# EAGLE board SuperLongboard-Lite 1.3.0 (EAGLE 9.7.0), part 1 of 3
REV: F
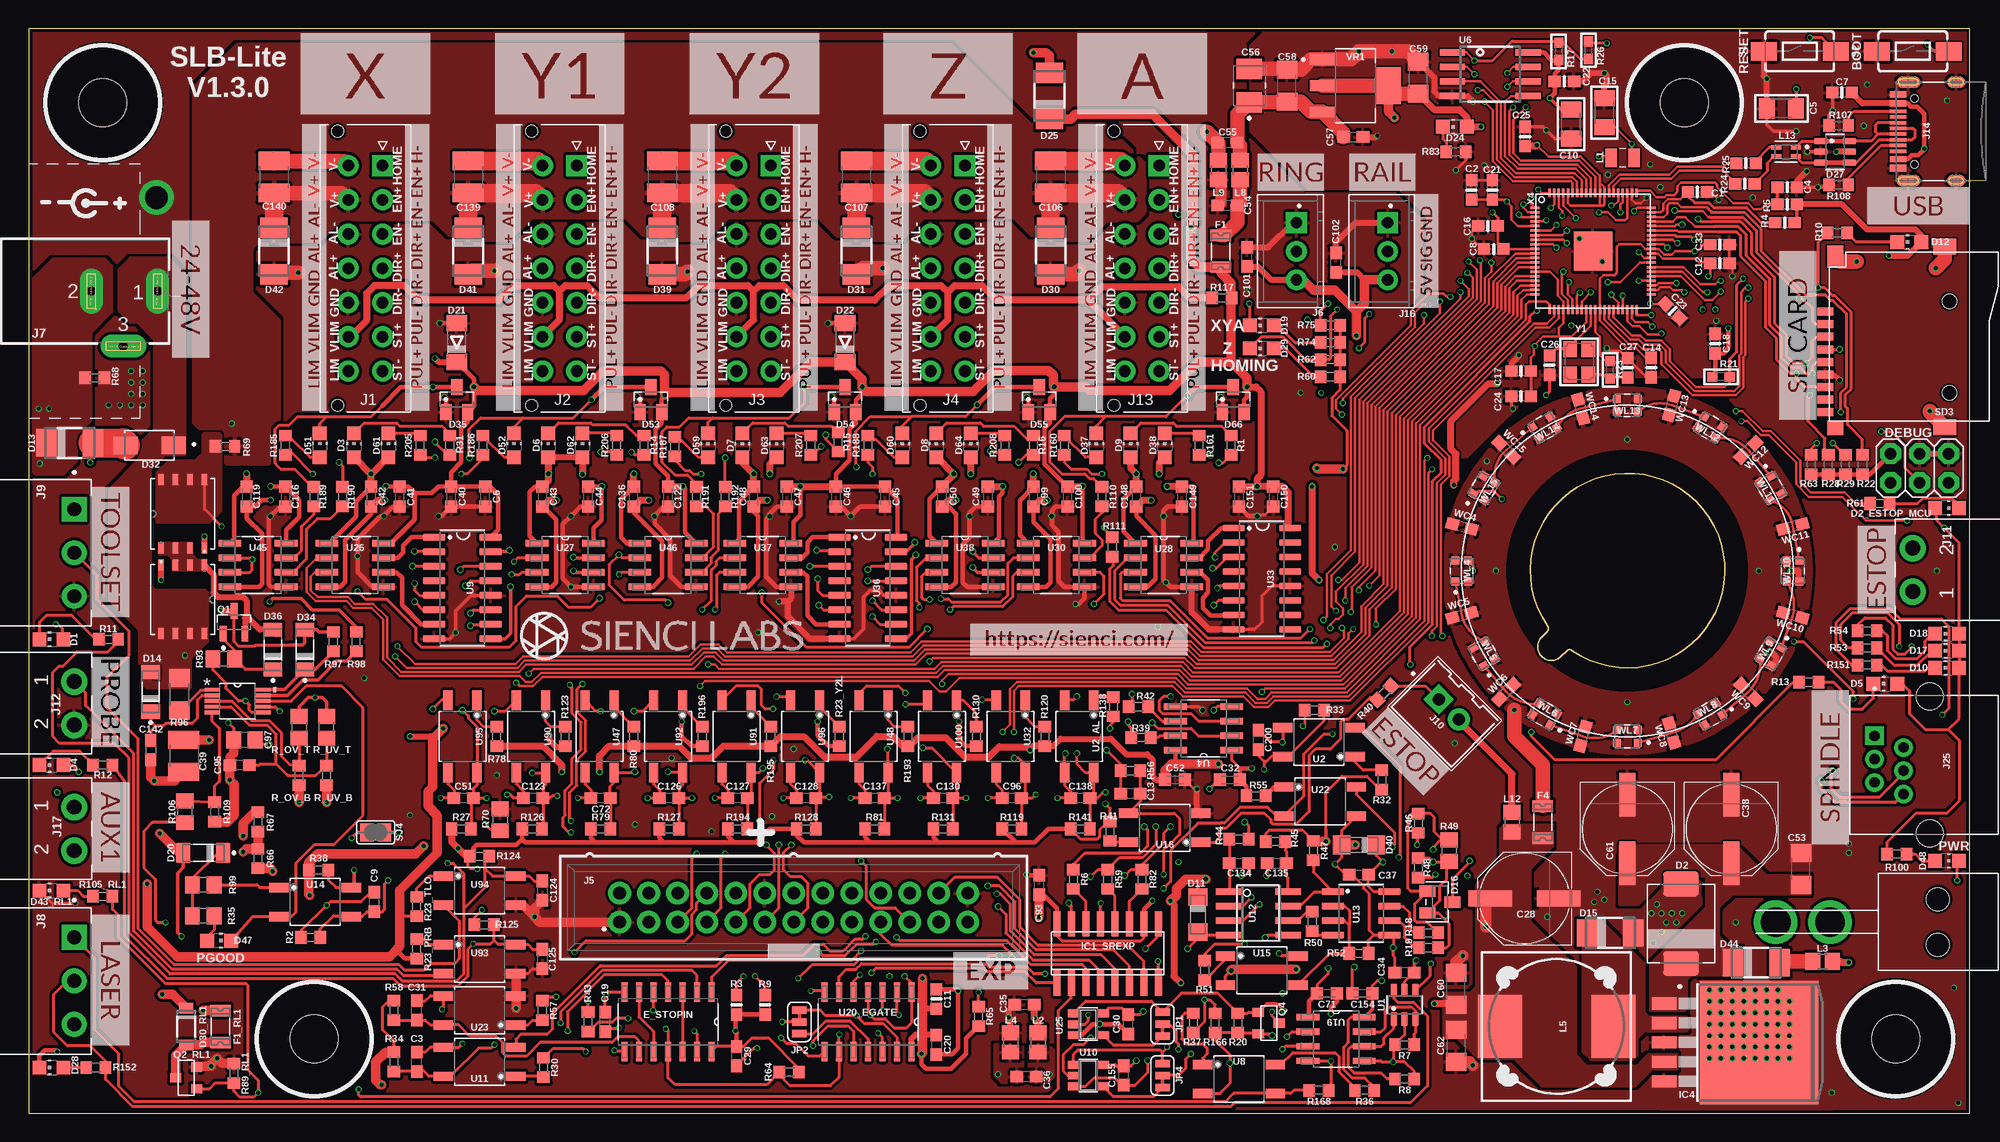
[diagram p12: board, top side]
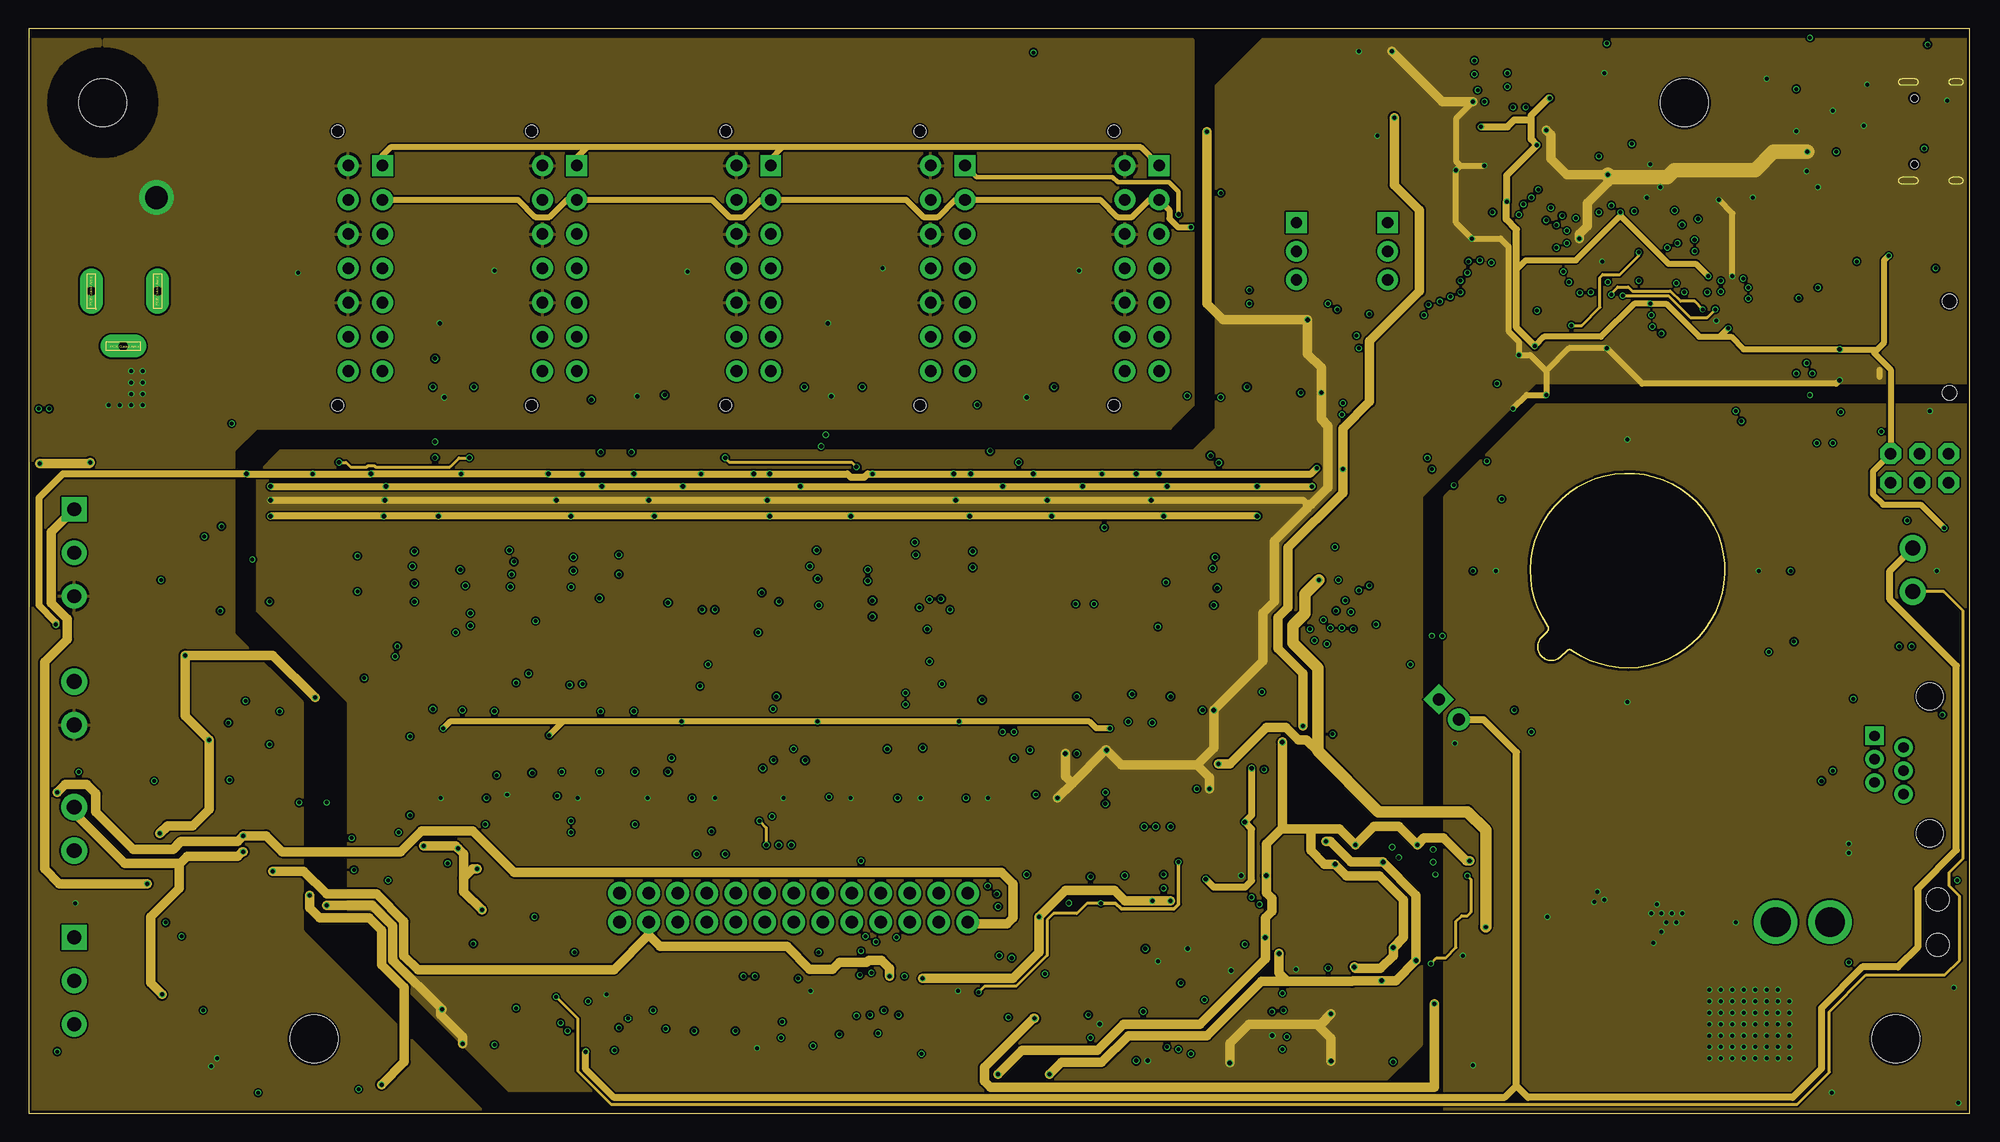
[diagram p13: board, inner layer Route2]
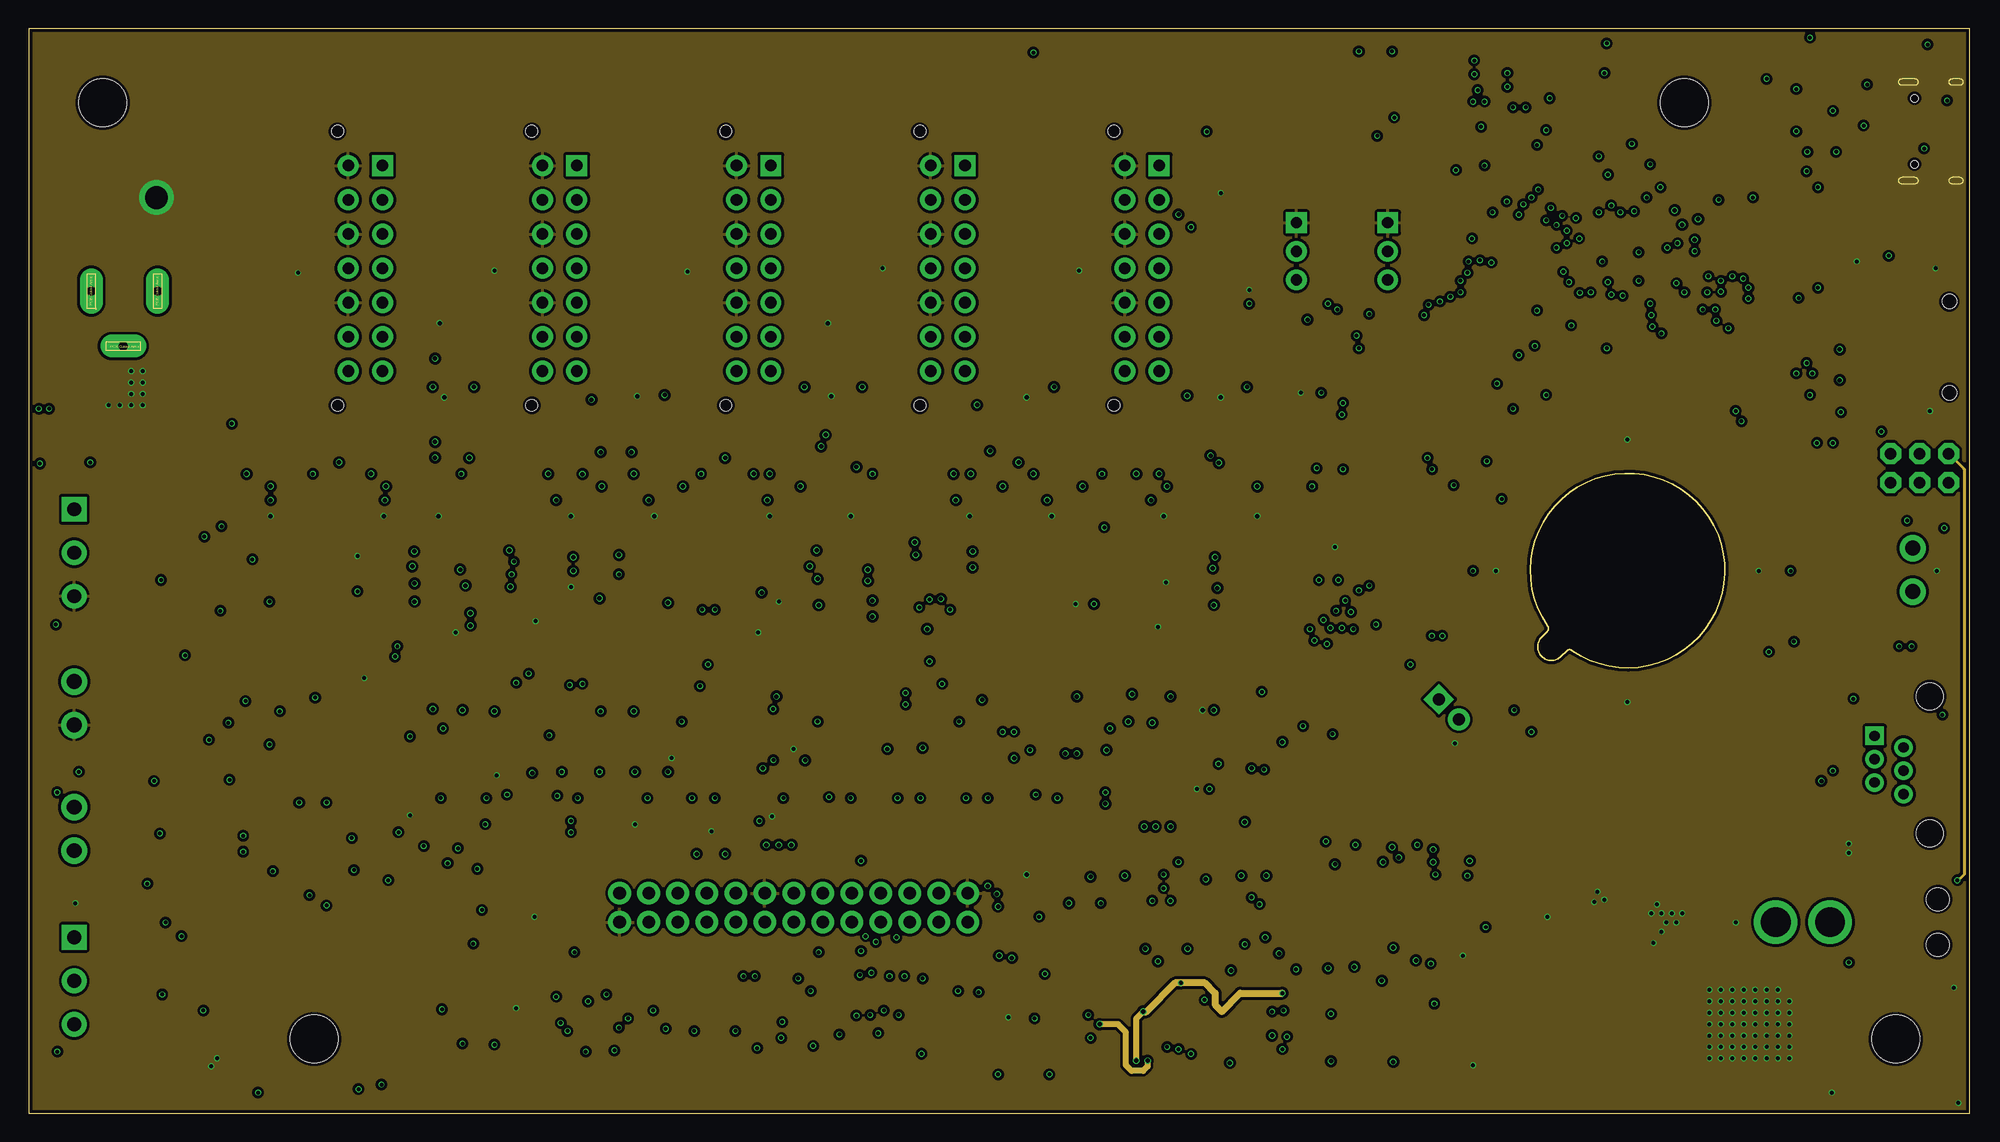
[diagram p14: board, inner layer Route15]
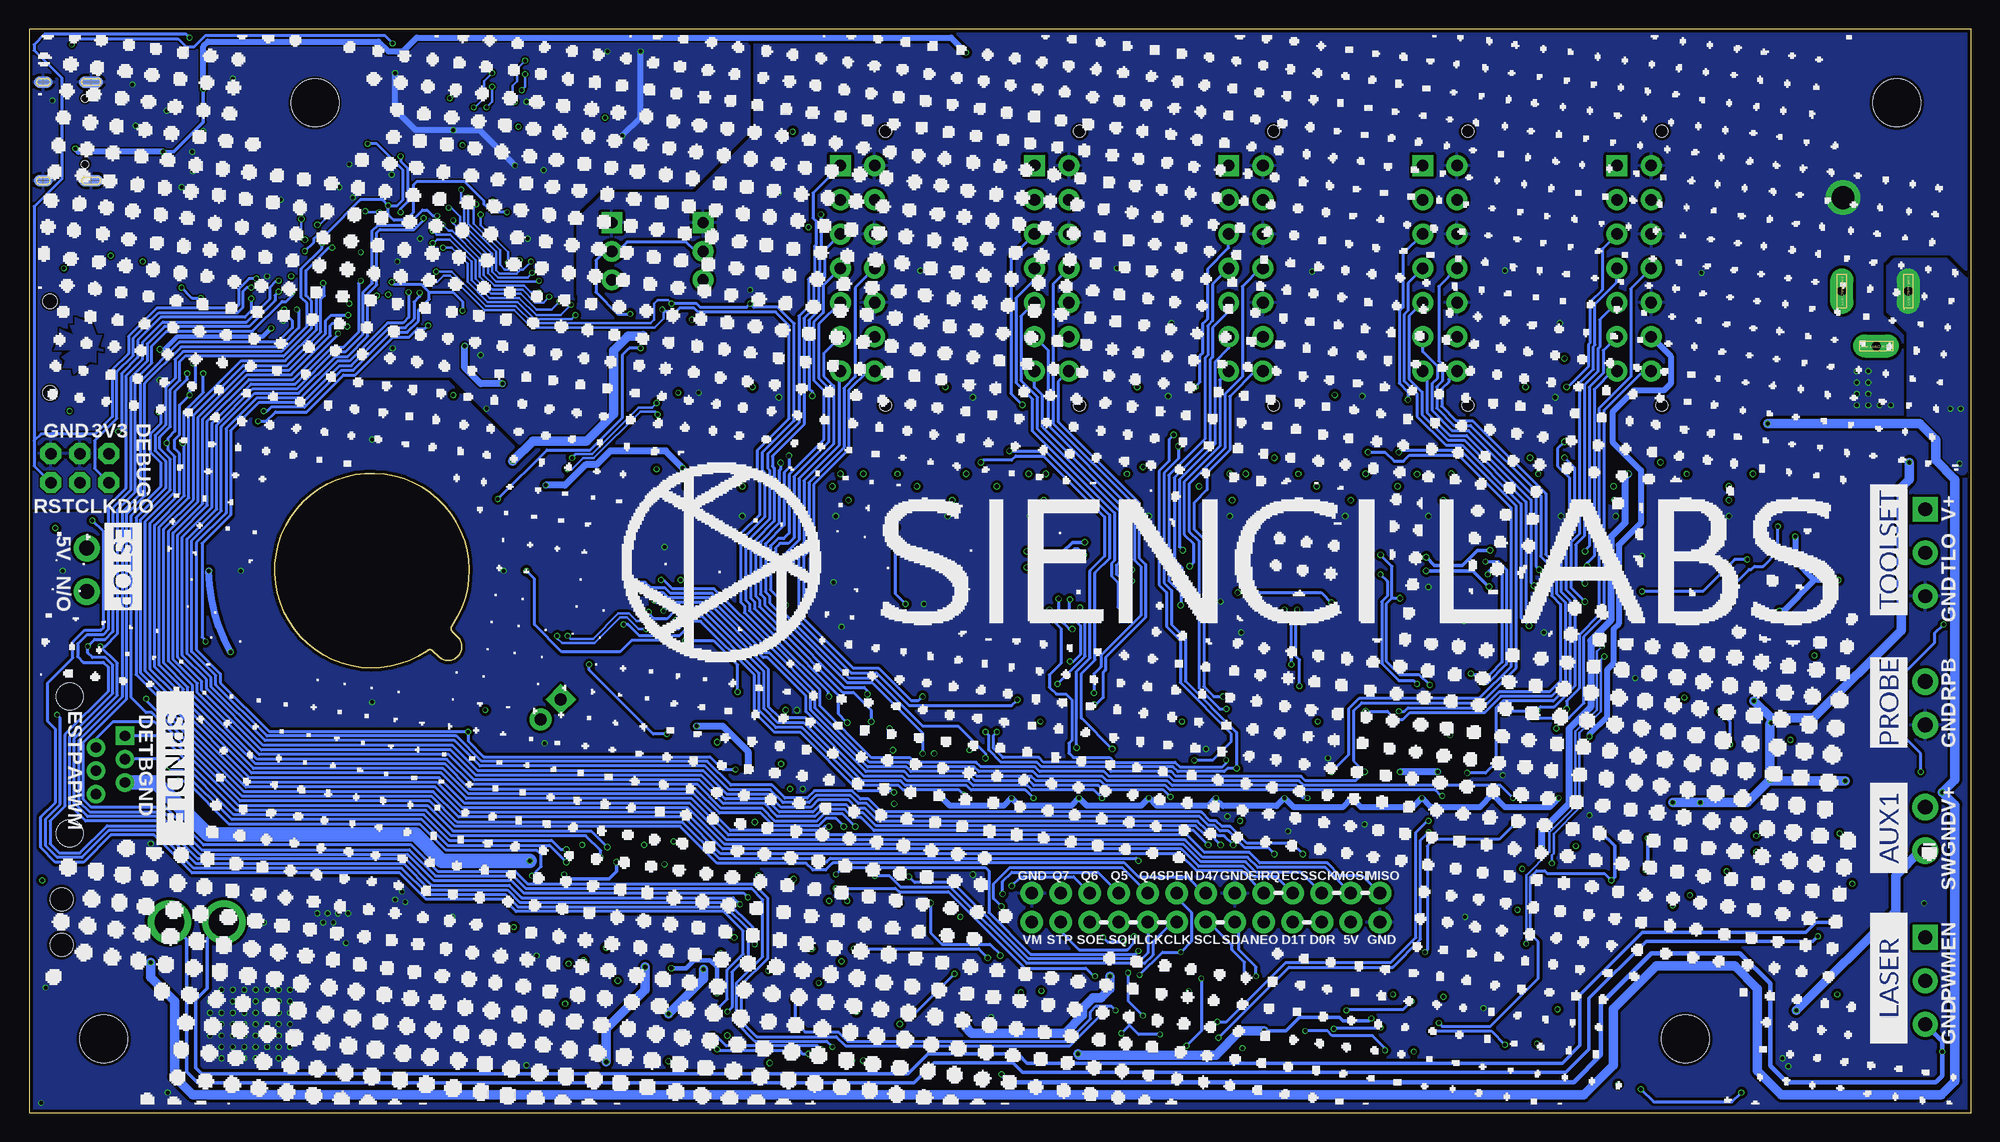
[diagram p15: board, bottom side, seen from below]

Size 170 x 95 mm. Coordinates in mm from the lower left corner, seen from the top.
Outline: 0,0 170,0 170,95 0,95 0,0
Outline: 133,42.7 arc-339 135.2,40.5 arc90 134.7,40.5 134.2,40 arc-180 132.5,41.7 133,42.2 arc90 133,42.7
Copper layers (1+2*15+16): Top 0.035mm / dielectric 1.6mm / Route2 0.035mm / dielectric 0.15mm / Route15 0.035mm / dielectric 0.2mm / Bottom 0.035mm
Design rules "jlcpcb-2layers *": minimum track width 5mil, minimum drill 0.3mm, track to track 5mil, track to pad 5mil, pad to pad 5mil, via to via 5mil, smd to smd 5mil, copper to edge 0.2mm, drill to drill 6mil, minimum pad ring 10mil, minimum via ring 3mil, stop-mask expansion 4mil, vias tented up to drill 40mil, thermal gap 10mil
Net classes: 0 default: width 0.152 mm, clearance 0.152 mm
Holes 4.2 mm at 25,6.5 163.5,6.5 145,88.5 6.5,88.5
tRestrict: area 158.4,1.4 to 168.6,11.6; area 1.4,83.4 to 11.6,93.6; area 19.9,1.4 to 30.1,11.6; area 139.9,83.4 to 150.1,93.6; area 129.5,37 to 150.5,58

## Footprints (pad centres in the part's own frame; a part is rotated, then mirrored left to right if it is on the bottom)
0603-NO = smd 1.075 x 1: 1 -0.85,0; 2 0.85,0
C0603 = smd 1.1 x 1: 1 -0.85,0; 2 0.85,0
_1206 = smd 1.4 x 1.8: 1 -1.27,0; 2 1.27,0
C0603K = smd 1.05 x 1.08: 1 -0.875,0; 2 0.875,0
PANASONIC_E = smd 3.8 x 1.4: + 3,0; - -3,0
C1210 = smd 1.6 x 2.7: 1 -1.4,0; 2 1.4,0
C1206 = smd 1.6 x 1.8: 1 -1.4,0; 2 1.4,0
CAPMP3528X210N = smd 1.79 x 2.21: 1 -1.46,0; 2 1.46,0
C0805 = smd 1.3 x 1.5: 1 -0.95,0; 2 0.95,0
CHIP-LED0805 = smd 1.2 x 1.2: A 0,-1.05; C 0,1.05
DIOM7959X262N = smd 2.18 x 3.12: A 3.485,0; C -3.485,0
LL-34 = smd 1.524 x 1.676: A -1.524,0; C 1.524,0
DO-214AC = smd 1.8 x 2.4: A 2.025,0; C -2.025,0
DIO_LL4148 = smd 1.2 x 1.65: A 1.75,0; C -1.75,0
SOT23 = smd 1 x 1.4: 1 -0.95,-1.1; 2 0.95,-1.1; 3 0,1.1
MINIMELF = smd 1.4 x 1.8: A 1.7,0; C -1.7,0
SOT95P280X145-6N = smd 1.21 x 0.59: 1 -1.255,0.95; 2 -1.255,0; 3 -1.255,-0.95; 4 1.255,-0.95; 5 1.255,0; 6 1.255,0.95
SOD123FL = smd 0.91 x 1.22: A 1.625,0; C -1.625,0
DIOM4325X250N = smd 2.12 x 1.5: A 2.115,0; C -2.115,0
SOT95P240X120-3N = smd 1.4 x 1: 1 -1.1,0.95; 2 -1.1,-0.95; 3 1.1,0
2X03 = drill 1.016 octagon: 1 -2.54,-1.27; 2 -2.54,1.27; 3 0,-1.27; 4 0,1.27; 5 2.54,-1.27; 6 2.54,1.27
SOIC127P600X175-14N = smd 1.702 x 0.533: 1 -2.591,3.81; 2 -2.591,2.54; 3 -2.591,1.27; 4 -2.591,0; 5 -2.591,-1.27; 6 -2.591,-2.54; 7 -2.591,-3.81; 8 2.591,-3.81; 9 2.591,-2.54; 10 2.591,-1.27; 11 2.591,0; 12 2.591,1.27; 13 2.591,2.54; 14 2.591,3.81
1206L = smd 1 x 1.8: 1 -1.4,0; 2 1.4,0
SOIC-16 = smd 0.6 x 2.2: 1 -4.445,-2.6; 2 -3.175,-2.6; 3 -1.905,-2.6; 4 -0.635,-2.6; 5 0.635,-2.6; 6 1.905,-2.6; 7 3.175,-2.6; 8 4.445,-2.6; 9 4.445,2.6; 10 3.175,2.6; 11 1.905,2.6; 12 0.635,2.6; 13 -0.635,2.6; 14 -1.905,2.6; 15 -3.175,2.6; 16 -4.445,2.6
TO263-5 = smd 1.067 x 2.159: 1 -3.404,-5.791; 2 -1.702,-5.791; 3 0,-5.791; 4 1.702,-5.791; 5 3.404,-5.791 | smd 10.8 x 10.41: 6 0,2.54
MOLEX_430451414 = drill 1.02 pad 1.52 square: 1 0,0 | drill 1.02 pad 1.52: 2 -3,0; 3 -6,0; 4 -9,0; 5 -12,0; 6 -15,0; 7 -18,0; 8 0,3; 9 -3,3; 10 -6,3; 11 -9,3; 12 -12,3; 13 -15,3; 14 -18,3 | hole 1.02: 3,3.94; -21,3.94
61202621621 = drill 1.1: 1 -15.24,-1.27; 2 -15.24,1.27; 3 -12.7,-1.27; 4 -12.7,1.27; 5 -10.16,-1.27; 6 -10.16,1.27; 7 -7.62,-1.27; 8 -7.62,1.27; 9 -5.08,-1.27; 10 -5.08,1.27; 11 -2.54,-1.27; 12 -2.54,1.27; 13 0,-1.27; 14 0,1.27; 15 2.54,-1.27; 16 2.54,1.27; 17 5.08,-1.27; 18 5.08,1.27; 19 7.62,-1.27; 20 7.62,1.27; 21 10.16,-1.27; 22 10.16,1.27; 23 12.7,-1.27; 24 12.7,1.27; 25 15.24,-1.27; 26 15.24,1.27
JST_B3B-XH-A(LF)(SN) = drill 1 square: 1 2.5,-0.525 | drill 1: 2 0,-0.525; 3 -2.5,-0.525
694108301002 = drill 0.8 pad 2 long: 1 5.8,0; 2 0,0; 3 2.8,-4.8
PHOENIX_1803280 = drill 1.2 pad 1.8 square: 01 2.6,8 | drill 1.2 pad 1.8: 02 6.41,8; 03 10.22,8
JST_B2B-XH-A_(LF)(SN) = drill 1.05 square: 1 1.25,-0.525 | drill 1.05: 2 -1.25,-0.525
MC1.5/2-G-3.81 = drill 1.3: 1 -3.81,8; 2 0,8
USB-C-16P = smd 0.3 x 1.45: A5 -1.25,0; A6 -0.25,0; A7 0.25,0; A8 1.25,0; B5 1.75,0; B6 0.75,0; B7 -0.75,0; B8 -1.75,0 | smd 0.6 x 1.45: GND -3.225,0; GND2 3.225,0 | smd 1 x 2.1: SHLD1 -4.32,-0.915; SHLD2 4.32,-0.915 | smd 1 x 2.1 bottom: SHLD3 -4.32,-0.915; SHLD4 4.32,-0.915 | smd 1 x 1.6: SHLD5 -4.32,-5.095; SHLD8 4.32,-5.095 | smd 1 x 1.6 bottom: SHLD6 -4.32,-5.095; SHLD7 4.32,-5.095 | smd 0.55 x 1.45: VBUS1 -2.45,0; VBUS2 2.45,0 | hole 0.65: -2.89,-1.445; 2.89,-1.445
KH-PCB-6P6C = drill 0.9 square: 1 2.55,4.84 | drill 0.9: 2 1.53,2.3; 3 0.51,4.84; 4 -0.51,2.3; 5 -1.53,4.84; 6 -2.55,2.3 | hole 2.36: -6,0; 6,0
SMT-JUMPER_3_1-NC_TRACE_SILK = smd 0.66 x 1.27: 1 -1.041,0; 2 0,0; 3 1.041,0
INDUCTOR-0806 = smd 1 x 1.6: 1 -1,0; 2 1,0
FB805 = smd 1.3 x 1.5: 1 -0.85,0; 2 0.85,0
DR127 = smd 3.85 x 5.5: 1 -4.975,0; 2 4.975,0
FIL_DLW21HN900SQ2L = smd 0.9 x 0.4: 1 -0.85,-0.4; 2 0.85,-0.4; 3 0.85,0.4; 4 -0.85,0.4
QNMOS_PRPAK5X6_HUA = smd 0.965 x 0.457: 1 -2.997,1.905; 2 -2.997,0.635; 3 -2.997,-0.635; 4 -2.997,-1.905; 5 2.997,-1.905; 6 2.997,-0.635; 7 2.997,0.635; 8 2.997,1.905
SOT95P237X125-3N = smd 1.37 x 0.61: 1 -0.99,0.95; 2 -0.99,-0.95; 3 0.99,0
SOT-23 = smd 0.802 x 0.972: P1 -0.95,-0.917; P2 0.95,-0.917; P3 0,0.917
R0603 = smd 1 x 1.1: 1 -0.85,0; 2 0.85,0
_0603 = smd 0.9 x 0.8: 1 -0.762,0; 2 0.762,0
R0805 = smd 1.3 x 1.5: 1 -0.95,0; 2 0.95,0
R1206 = smd 1.6 x 1.803: 1 -1.422,0; 2 1.422,0
TACTILE_SWITCH_SMD_6.0X3.5MM = smd 2.3 x 1.6: 1 -3.15,0; 2 3.15,0
TF-PULL = smd 0.7 x 1.4: 1 -2.2,-7.62; 2 -1.1,-7.62; 3 0,-7.62; 4 1.1,-7.62; 5 2.2,-7.62; 6 3.3,-7.62; 7 4.4,-7.62; 8 5.5,-7.62; 9 6.6,-7.62 | smd 1.4 x 2: S1 -7.9,2.85; S2 7.9,2.85 | smd 1.28 x 1.4: S3 7.96,-6.75 | smd 1.95 x 1.4: S4 -7.025,-6.75 | hole 1.25: -3.1,3.25; 4.9,3.25
SJ = smd 1.168 x 1.6: 1 -0.762,0; 2 0.762,0
KCD11-BL = drill 2.6 pad 3.81: P$1 0,-14.75; P$2 0,-19.5 | hole 2: -2,-5.3; 2,-5.3
SOT95P280X145-6N' = smd 1.21 x 0.58: 1 -1.255,0.95; 2 -1.255,0; 3 -1.255,-0.95; 4 1.255,-0.95; 5 1.255,0; 6 1.255,0.95
OPTO_EL357N-G = smd 1.676 x 0.813: 1 -3.175,1.27; 2 -3.175,-1.27; 3 3.175,-1.27; 4 3.175,1.27
MUB10A = smd 1.372 x 0.33: 1 -2.197,1; 2 -2.197,0.5; 3 -2.197,0; 4 -2.197,-0.5; 5 -2.197,-1; 6 2.197,-1; 7 2.197,-0.5; 8 2.197,0; 9 2.197,0.5; 10 2.197,1
SOIC127P600X175-8N = smd 1.981 x 0.559: 1 -2.464,1.905; 2 -2.464,0.635; 3 -2.464,-0.635; 4 -2.464,-1.905; 5 2.464,-1.905; 6 2.464,-0.635; 7 2.464,0.635; 8 2.464,1.905
SOIC8_208MIL = smd 0.6 x 2.2: 1 -1.905,-3.315; 2 -0.635,-3.315; 3 0.635,-3.315; 4 1.905,-3.315; 5 1.905,3.315; 6 0.635,3.315; 7 -0.635,3.315; 8 -1.905,3.315
SOIC127P600X175-16N = smd 1.97 x 0.6: 1 -2.475,4.445; 2 -2.475,3.175; 3 -2.475,1.905; 4 -2.475,0.635; 5 -2.475,-0.635; 6 -2.475,-1.905; 7 -2.475,-3.175; 8 -2.475,-4.445; 9 2.475,-4.445; 10 2.475,-3.175; 11 2.475,-1.905; 12 2.475,-0.635; 13 2.475,0.635; 14 2.475,1.905; 15 2.475,3.175; 16 2.475,4.445
SOT23-5 = smd 0.69 x 0.99: 1 -0.95,-1.29; 2 0,-1.29; 3 0.95,-1.29; 4 0.95,1.3; 5 -0.95,1.3
SOIC-8 = smd 0.6 x 2.2: 1 -1.905,-2.6; 2 -0.635,-2.6; 3 0.635,-2.6; 4 1.905,-2.6; 5 1.905,2.6; 6 0.635,2.6; 7 -0.635,2.6; 8 -1.905,2.6
SOIC127P599X175-8N = smd 1.97 x 0.6: 1 -2.47,1.905; 2 -2.47,0.635; 3 -2.47,-0.635; 4 -2.47,-1.905; 5 2.47,-1.905; 6 2.47,-0.635; 7 2.47,0.635; 8 2.47,1.905
AMS1117-3.3 = smd 2.15 x 0.95: 1 -2.9,2.3; 2 -2.9,0; 3 -2.9,-2.3 | smd 2.15 x 3.25: 4 2.9,0
LED_WS2812-2020 = smd 0.7 x 0.7: 1 0.915,-0.55; 2 0.915,0.55; 3 -0.915,0.55; 4 -0.915,-0.55
QFN80 = smd 0.78 x 0.22: 1 -5.09,3.8; 2 -5.09,3.4; 3 -5.09,3; 4 -5.09,2.6; 5 -5.09,2.2; 6 -5.09,1.8; 7 -5.09,1.4; 8 -5.09,1; 9 -5.09,0.6; 10 -5.09,0.2; 11 -5.09,-0.2; 12 -5.09,-0.6; 13 -5.09,-1; 14 -5.09,-1.4; 15 -5.09,-1.8; 16 -5.09,-2.2; 17 -5.09,-2.6; 18 -5.09,-3; 19 -5.09,-3.4; 20 -5.09,-3.8; 41 5.1,-3.8; 42 5.1,-3.4; 43 5.1,-3; 44 5.1,-2.6; 45 5.1,-2.2; 46 5.1,-1.8; 47 5.1,-1.4; 48 5.1,-1; 49 5.1,-0.6; 50 5.1,-0.2; 51 5.1,0.2; 52 5.1,0.6; 53 5.1,1; 54 5.1,1.4; 55 5.1,1.8; 56 5.1,2.2; 57 5.1,2.6; 58 5.1,3; 59 5.1,3.4; 60 5.1,3.8 | smd 0.22 x 0.78: 21 -3.8,-5.1; 22 -3.4,-5.1; 23 -3,-5.1; 24 -2.6,-5.1; 25 -2.2,-5.1; 26 -1.8,-5.1; 27 -1.4,-5.1; 28 -1,-5.1; 29 -0.6,-5.1; 30 -0.2,-5.1; 31 0.2,-5.1; 32 0.6,-5.1; 33 1,-5.1; 34 1.4,-5.1; 35 1.8,-5.1; 36 2.2,-5.1; 37 2.6,-5.1; 38 3,-5.1; 39 3.4,-5.1; 40 3.8,-5.1; 61 3.8,5.1; 62 3.4,5.1; 63 3,5.1; 64 2.6,5.1; 65 2.2,5.1; 66 1.8,5.1; 67 1.4,5.1; 68 1,5.1; 69 0.6,5.1; 70 0.2,5.1; 71 -0.2,5.1; 72 -0.6,5.1; 73 -1,5.1; 74 -1.4,5.1; 75 -1.8,5.1; 76 -2.2,5.1; 77 -2.6,5.1; 78 -3,5.1; 79 -3.4,5.1; 80 -3.8,5.1 | smd 3.4 x 3.4: MNT 0,0
CRYSTAL_3.2X2.5 = smd 1.4 x 1.2: 1 -1.1,-0.8; 2 1.1,0.8; GND1 -1.1,0.8; GND2 1.1,-0.8

## Placement (x,y rotation side)
C1  2.2uF  [0603-NO]  146.15,80.69 0 top
C2  1uF  [0603-NO]  126.36,80.87 90 top
C3  100nF  [C0603]  34,4.5 90 top
C4  2.2uF  [0603-NO]  154,81.1 0 top
C5  10uF  [_1206]  153.5,88 0 top
C6  100nF  [C0603K]  40,54 270 top
C7  100nF  [0603-NO]  158.8,89.4 180 top
C8  100nF  [0603-NO]  128.3,75.68 0 top
C9  100nF  [C0603]  30.3,18.5 90 top
C10  10uF  [_1206]  135.08,86.61 270 top
C11  1uF  [0603-NO]  79.5,10 90 top
C12  1uF  [0603-NO]  148.1,74.45 0 top
C13  100nF  [C0603]  96.5,28 180 top
C14  100nF  [0603-NO]  142.1,65.3 90 top
C15  10uF  [_1206]  138,87.63 270 top
C16  1uF  [0603-NO]  127.8,77.7 180 top
C17  100nF  [0603-NO]  130.7,65 180 top
C18  100nF  [0603-NO]  147.7,67.4 90 top
C19  100nF  [C0603]  50.5,8 90 top
C20  100nF  [C0603]  79.5,6 270 top
C21  100nF  [0603-NO]  128.19,80.87 90 top
C22  100nF  [0603-NO]  134.49,90.38 0 top
C23  100nF  [0603-NO]  143.96,70.27 315 top
C24  100nF  [0603-NO]  130.7,62.8 180 top
C25  100nF  [0603-NO]  131.05,85.54 90 top
C26  15pF  [0603-NO]  133.18,65.51 90 top
C27  15pF  [0603-NO]  140.02,65.28 270 top
C28  220µF 16-50V  [PANASONIC_E]  131,18.8 180 top
C29  100nF  [C0603]  62,5 270 top
C30  100nF  [C0603]  96.3,7.8 90 top
C31  100nF  [C0603]  34,9 90 top
C32  100nF  [C0603K]  105.2,29.2 180 top
C33  100nF  [0603-NO]  148.1,76.07 180 top
C34  100nF  [C0603]  120.5,12.3 180 top
C35  4.7uF 16V  [C0603]  87.2,9.5 180 top
C36  22uF  [C0603]  87.4,3.2 180 top
C37  1uF  [C0603]  116.5,20.9 0 top
C38  100uF 63-100V  [PANASONIC_E]  149.1,24.9 270 top
C39  4.7uF 63V  [C1210]  13.6,31.3 270 top
C40  1uF  [C0603K]  37,54 270 top
C41  100nF  [C0603K]  32.5,54 270 top
C42  100nF  [C0603K]  30,54 270 top
C43  100nF  [C0603K]  45,54 270 top
C44  100nF  [C0603K]  49,54 270 top
C45  100nF  [C0603K]  75,54 270 top
C46  1uF  [C0603K]  70.7,54 270 top
C47  100nF  [C0603K]  66.4,54 270 top
C48  100nF  [C0603K]  63.5,54 270 top
C49  100nF  [C0603K]  84,54 270 top
C50  100nF  [C0603K]  80,54 270 top
C51  100nF  [C0603]  38.1,27.6 180 top
C52  100nF  [C0603K]  100.4,29.2 0 top
C53  10uF 63v  [C1206]  155.2,21.4 90 top
C54  4.7uF  [C0603]  105,79.5 180 top
C55  22uF  [C0603]  105,85 180 top
C56  100uF  [CAPMP3528X210N]  106.9,90 90 top
C57  22uF  [C0603]  116,85.5 0 top
C58  10uF  [C1206]  110.2,90 90 top
C59  10uF  [C1206]  121.7,90.7 90 top
C60  10uF  [C1206]  125,10.9 90 top
C61  100uF 63-100V  [PANASONIC_E]  140,24.9 270 top
C62  10uF  [C1206]  125,5.9 270 top
C71  100nF  [C0603K]  113.7,10.5 0 top
C72  100nF  [C0603]  50.1,27.6 180 top
C93  100nF  [C0603]  88.5,20 90 top
C95  100nF  [C0603]  18.5,30.5 180 top
C96  100nF  [C0603]  86.1,27.6 180 top
C97  47nF  [C0805]  18.9,32.7 180 top
C99  100nF  [C0603K]  88,54 270 top
C100  100nF  [C0603K]  91,54 270 top
C101  100nF  [C0603]  106.7,75 90 top
C102  100nF  [C0603]  114.5,74.5 90 top
C106  2.2uF 100v  [C1210]  89.5,82 270 top
C107  2.2uF 100v  [C1210]  72.5,82 270 top
C108  2.2uF 100v  [C1210]  55.5,82 270 top
C116  100nF  [C0603K]  22.5,54 270 top
C119  100nF  [C0603K]  19.1,54 270 top
C122  100nF  [C0603K]  56,54 270 top
C123  100nF  [C0603]  44.2,27.6 180 top
C124  100nF  [C0603]  45,19.5 270 top
C125  100nF  [C0603]  45,13.5 270 top
C126  100nF  [C0603]  56.1,27.6 180 top
C127  100nF  [C0603]  62.1,27.6 180 top
C128  100nF  [C0603]  68.1,27.6 180 top
C130  100nF  [C0603]  80.1,27.6 180 top
C134  100nF  [C0603]  106,21.9 0 top
C135  100nF  [C0603]  109.3,21.9 0 top
C136  100nF  [C0603K]  53,54 270 top
C137  100nF  [C0603]  74.1,27.6 180 top
C138  100nF  [C0603]  92.1,27.6 180 top
C139  2.2uF 100v  [C1210]  38.5,82 270 top
C140  2.2uF 100v  [C1210]  21.5,82 270 top
C142  100nF  [C0603]  10.7,31.8 270 top
C148  100nF  [C0603K]  97,54 270 top
C149  100nF  [C0603K]  101,54 270 top
C150  100nF  [C0603K]  109,54 270 top
C151  1uF  [C0603K]  106,54 270 top
C154  100nF  [C0603K]  116.8,10.5 180 top
C155  100nF  [C0603]  95.9,3.3 90 top
C200  100nF  [C0603]  107.7,32.7 90 top
D1  YELLOW  [CHIP-LED0805]  2,41.5 90 top
D2  SMCJ54A  [DIOM7959X262N]  144.7,16.6 90 top
D2_ESTOP_MCU  RED  [CHIP-LED0805]  168,53 270 top
D3  YELLOW  [CHIP-LED0805]  28.5,58.5 0 top
D4  YELLOW  [CHIP-LED0805]  2,30.5 90 top
D5  BLUE  [CHIP-LED0805]  162.6,37.6 90 top
D6  YELLOW  [CHIP-LED0805]  45.5,58.5 0 top
D7  YELLOW  [CHIP-LED0805]  62.5,58.5 0 top
D8  YELLOW  [CHIP-LED0805]  79.5,58.5 0 top
D9  YELLOW  [CHIP-LED0805]  96.5,58.5 0 top
D10  WHITE  [CHIP-LED0805]  168,39 90 top
D11  ZMM3V3-M  [LL-34]  102.4,17.4 90 top
D12  GREEN  [CHIP-LED0805]  164.7,76.3 90 top
D13  SS510  [DO-214AC]  3.6,58.7 0 top
D14  LL4148  [DIO_LL4148]  10.7,36.9 90 top
D15  SS510  [DO-214AC]  138.5,15.8 0 top
D16  SM712  [SOT23]  123.6,18.5 270 top
D17  YELLOW  [CHIP-LED0805]  168,40.5 90 top
D18  GREEN  [CHIP-LED0805]  168,42 90 top
D19  GREEN  [CHIP-LED0805]  108,69 90 top
D20  LL4148  [DIO_LL4148]  15.3,22.8 180 top
D21  ZMM5V6-M  [MINIMELF]  37.5,67.5 90 top
D22  ZMM5V6-M  [MINIMELF]  71.5,67.5 90 top
D24  GREEN  [CHIP-LED0805]  124.9,86.4 90 top
D25  SS34_DNI  [DO-214AC]  89.4,89.1 90 top
D27  USBLC6-2SC6  [SOT95P280X145-6N]  158.2,84.2 0 top
D28  GREEN  [CHIP-LED0805]  2,4 90 top
D29  GREEN  [CHIP-LED0805]  108,67 90 top
D30  SS510  [DO-214AC]  89.5,75.5 270 top
D30_RL1  B5819W  [SOD123FL]  13.8,7.6 270 top
D31  SS510  [DO-214AC]  72.5,75.5 270 top
D32  SMAJ48A  [DIOM4325X250N]  10.6,58.5 180 top
D34  LL4148  [DIO_LL4148]  24.2,40.6 90 top
D35  BAT54S  [SOT95P240X120-3N]  37.5,62.5 90 top
D36  LL4148  [DIO_LL4148]  21.4,40.6 90 top
D37  RED  [CHIP-LED0805]  93.5,58.5 0 top
D38  RED  [CHIP-LED0805]  99.5,58.5 0 top
D39  SS510  [DO-214AC]  55.5,75.5 270 top
D40  ZMM5V6-M  [LL-34]  116.5,23.5 0 top
D41  SS510  [DO-214AC]  38.5,75.5 270 top
D42  SS510  [DO-214AC]  21.5,75.5 270 top
D43_RL1  GREEN  [CHIP-LED0805]  2,19.5 90 top
D44  SS510  [DO-214AC]  151.3,13.2 0 top
D47  GREEN  [CHIP-LED0805]  16.7,15.1 270 top
D48  GREEN  [CHIP-LED0805]  168,22.1 270 top
D51  RED  [CHIP-LED0805]  25.5,58.5 0 top
D52  RED  [CHIP-LED0805]  42.5,58.5 0 top
D53  BAT54S  [SOT95P240X120-3N]  54.5,62.5 90 top
D54  BAT54S  [SOT95P240X120-3N]  71.5,62.5 90 top
D55  BAT54S  [SOT95P240X120-3N]  88.5,62.5 90 top
D59  RED  [CHIP-LED0805]  59.5,58.5 0 top
D60  RED  [CHIP-LED0805]  76.5,58.5 0 top
D61  RED  [CHIP-LED0805]  31.5,58.5 0 top
D62  RED  [CHIP-LED0805]  48.5,58.5 0 top
D63  RED  [CHIP-LED0805]  65.5,58.5 0 top
D64  RED  [CHIP-LED0805]  82.5,58.5 0 top
D66  BAT54S  [SOT95P240X120-3N]  105.5,62.5 90 top
DEBUG  DNI  [2X03]  165.6,56.5 0 top
E_STOPIN  74HC08D-T  [SOIC127P600X175-14N]  56,8 270 top
F1  2A  [1206L]  104.4,75.5 90 top
F1_RL1  24V 460mA  [1206L]  16.8,7.6 270 top
F4  2A  [1206L]  132.6,25.5 90 top
IC1_SREXP  74HC595  [SOIC-16]  94.5,14 0 top
IC4  LM2596HV-5  [TO263-5]  149,6.2 270 top
J1  430451414  [MOLEX_430451414]  31,83 90 top
J2  430451414  [MOLEX_430451414]  48,83 90 top
J3  430451414  [MOLEX_430451414]  65,83 90 top
J4  430451414  [MOLEX_430451414]  82,83 90 top
J5  Connector IDC Header Through Hole 26 position 2.54mm  [61202621621]  67,18 0 top
J6  B3B-XH-A(LF)(SN)  [JST_B3B-XH-A(LF)(SN)]  110.5,75.5 90 top
J7  5.5x2.1mm >5A  [694108301002]  5.5,72 0 top
J8  DB2ERC-3.81-3P-BK  [PHOENIX_1803280]  -4,18 270 top
J9  DB2ERC-3.81-3P-BK  [PHOENIX_1803280]  -4,55.5 270 top
J10  B2B-XH-A_(LF)(SN)  [JST_B2B-XH-A_(LF)(SN)]  124,35 135 top
J11  DB2ERC-3.81-2P-BK  [MC1.5/2-G-3.81]  173,49.5 90 top
J12  DB2ERC-3.81-2P-BK  [MC1.5/2-G-3.81]  -4,34 270 top
J13  430451414  [MOLEX_430451414]  99,83 90 top
J14  TYPE-C 16PIN 2MD(073)  [USB-C-16P]  163.7,86 90 top
J16  B3B-XH-A(LF)(SN)  [JST_B3B-XH-A(LF)(SN)]  118.5,75.5 90 top
J17  DB2ERC-3.81-2P-BK  [MC1.5/2-G-3.81]  -4,23 270 top
J25  DS1133-S60BPX  [KH-PCB-6P6C]  166.5,30.5 90 top
JP1  DNI  [SMT-JUMPER_3_1-NC_TRACE_SILK]  99.3,7.8 270 top
JP2  DNI  [SMT-JUMPER_3_1-NC_TRACE_SILK]  67.5,8 90 top
JP4  DNI  [SMT-JUMPER_3_1-NC_TRACE_SILK]  99.3,3.3 270 top
L1  AOTA-B201610S3R3-101-T  [INDUCTOR-0806]  139.59,83.66 180 top
L2  150mΩ ±25% 220Ω@100MHz 0805 Ferrite Beads ROHS  [FB805]  88.4,6.2 270 top
L3  2.2uH 116mOhm  [FB805]  157.1,13.3 180 top
L4  150mΩ ±25% 220Ω@100MHz 0805 Ferrite Beads ROHS  [FB805]  86,6.2 270 top
L5  SDRI127-680MT  [DR127]  133.8,7.6 180 top
L8  150mΩ ±25% 220Ω@100MHz 0805 Ferrite Beads ROHS  [FB805]  106.1,82.6 90 top
L9  150mΩ ±25% 220Ω@100MHz 0805 Ferrite Beads ROHS  [FB805]  104.2,82.6 90 top
L12  150mΩ ±25% 220Ω@100MHz 0805 Ferrite Beads ROHS  [FB805]  129.9,25.5 270 top
L13  DLW21HN900SQ2L  [FIL_DLW21HN900SQ2L]  153.9,84.2 180 top
MOSFET1  BSC070N10NS3G  [QNMOS_PRPAK5X6_HUA]  13.5,45 270 top
MOSFET2  BSC070N10NS3G  [QNMOS_PRPAK5X6_HUA]  13.5,52.5 90 top
Q1  MMBT3904-TP  [SOT95P237X125-3N]  18,43 90 top
Q2_RL1  ST3422A  [SOT-23]  13.8,3.1 90 top
Q4  2N7002-7-F  [SOT-23]  108.6,7.9 270 top
R1  1K  [R0603]  105.3,58.5 270 top
R2  10K  [R0603]  24.7,15.4 0 top
R3  10K  [0603-NO]  62,9.5 90 top
R4  200R  [0603-NO]  153.8,78 0 top
R5  10R  [0603-NO]  154,79.6 180 top
R6  100R  [R0603]  91.5,20.5 270 top
R7  10K  [R0603]  120.5,6 180 top
R8  10K  [R0603]  120.5,3 0 top
R9  10K  [0603-NO]  64.5,9.5 90 top
R10  2K  [R0603]  158.4,77.1 0 top
R11  1K  [R0603]  7,41.5 0 top
R12  1K  [R0603]  6.5,30.5 0 top
R13  1K  [R0603]  155.9,37.75 180 top
R14  1K  [R0603]  53.9,58.5 270 top
R15  1K  [R0603]  70.9,58.8 270 top
R16  1K  [R0603]  88,58.5 270 top
R17  10K  [_0603]  134,93 270 top
R18  10R  [R0603]  122.6,15.8 0 top
R19  10R  [R0603]  122.6,14.5 0 top
R20  10K  [R0603]  105.9,7.9 90 top
R21  10K  [_0603]  148.2,64.5 0 top
R22  10K  [R0603]  160.6,56.8 90 top
R23  1K  [_0603]  138.49,65.11 90 top
R23_PRB  1K  [R0603]  34,14.4 270 top
R23_TLO  1K  [R0603]  34,18.1 270 top
R23_Y2L  1K  [R0603]  71,33 270 top
R24  22R  [0603-NO]  150.3,81.4 180 top
R25  22R  [0603-NO]  150.4,83.2 180 top
R26  1K  [_0603]  136.6,93.1 90 top
R27  10K  [R0603]  37.9,24.9 180 top
R28  10K  [R0603]  157.6,56.8 90 top
R29  10K  [R0603]  159.1,56.8 90 top
R30  510R  [R0603]  45.1,4 90 top
R31  1K  [R0603]  36.9,58.5 270 top
R32  1K  [R0603]  118.5,29.2 270 top
R33  4K7  [R0603]  112.6,35.3 0 top
R34  10K  [R0603]  32,4.5 90 top
R35  12K  [R0805]  15.3,17.3 180 top
R36  220R  [R0603]  117,2 180 top
R37  220R  [R0603]  102,7.9 270 top
R38  120R  [R0603]  25.4,21.3 180 top
R39  200R  [R0603]  97.4,32.9 0 top
R40  510R  [R0603]  118.7,36.8 45 top
R41  120R  [R0603]  94.7,24.7 90 top
R42  200R  [R0603]  97.2,35.6 0 top
R43  10K  [R0603]  49,8 270 top
R44  200R  [R0603]  106,24 0 top
R45  200R  [R0603]  109.2,23.8 180 top
R46  560R  [R0603]  121.7,25.4 90 top
R47  2K  [R0603]  112.5,23 90 top
R48  560R  [R0603]  121.7,21.5 270 top
R49  130R  [R0805]  124.4,23 270 top
R50  200R  [R0603]  112.4,16.8 90 top
R51  220R  [R0603]  103,12.5 90 top
R52  2K  [R0603]  116.5,14 0 top
R53  470R  [R0603]  161,40.75 0 top
R54  470R  [R0603]  161,42.25 0 top
R55  220R  [R0603]  107.5,27.8 180 top
R56  10K  [R0603]  96.5,30 0 top
R57  510R  [R0603]  45,9 90 top
R58  10K  [R0603]  32,9 90 top
R59  100R  [R0603]  94.5,20.5 270 top
R60  2K  [R0603]  114,64.5 0 top
R61  2K  [R0603]  162.1,53.4 0 top
R62  10K  [R0603]  114,66 0 top
R63  10K  [R0603]  156.1,56.8 90 top
R64  10K  [R0603]  66.6,3.6 0 top
R65  10k  [R0603]  83.2,8.5 270 top
R66  0R  [R0603]  20.1,22.3 270 top
R67  DNI  [R0603]  20.1,25.5 90 top
R68  0R  [R0603]  5.8,64.4 180 top
R69  0R  [R0603]  17.2,58.4 180 top
R70  100K  [R0805]  41.3,25.7 90 top
R74  2K  [R0603]  114,67.5 0 top
R75  10K  [R0603]  114,69 0 top
R78  1K  [R0603]  41,33 90 top
R79  10K  [R0603]  50.1,24.9 180 top
R80  1K  [R0603]  53,33 90 top
R81  10K  [R0603]  74.1,24.9 180 top
R82  100R  [R0603]  97.5,20.5 270 top
R83  2K  [R0603]  125,84.2 0 top
R89_RL1  10K  [R0603]  18,3.5 270 top
R93  33K  [R0805]  17.1,39.8 0 top
R96  7K15  [R1206]  13.2,36.7 90 top
R97  2K  [R0603]  26.7,41.3 90 top
R98  10K  [R0603]  28.7,41.3 90 top
R99  12K  [R0805]  15.3,20 180 top
R100  2K  [R0603]  163.6,22.7 180 top
R105_RL1  2K  [R0603]  6.5,19 0 top
R106  47K  [R0805]  13.7,26.4 270 top
R107  4K7  [R0603]  158.5,86.5 0 top
R108  4K7  [R0603]  158.5,81.3 0 top
R109  10K  [R0603]  16.3,26.4 90 top
R110  200R  [R0603]  94,54 270 top
R111  200R  [R0603]  94.9,49.6 90 top
R117  0R  [R0603]  104.5,71.4 180 top
R119  10K  [R0603]  86.1,24.9 0 top
R120  1K  [R0603]  89,33 270 top
R123  1K  [R0603]  47,33 270 top
R124  4K7  [R0603]  39.5,22.5 0 top
R125  4K7  [R0603]  39.9,16.5 0 top
R126  4K7  [R0603]  44.1,24.9 0 top
R127  4K7  [R0603]  56.1,24.9 0 top
R128  4K7  [R0603]  68.1,24.9 0 top
R130  1K  [R0603]  83,33 270 top
R131  4K7  [R0603]  80.1,24.9 0 top
R138  1K  [R0603]  95,35.6 270 top
R141  4K7  [R0603]  92.1,24.9 0 top
R151  470R  [R0603]  161,39.25 0 top
R152  4K7  [R0603]  5.9,4 0 top
R160  470R  [R0603]  90.7,58.5 270 top
R161  470R  [R0603]  102.5,58.5 270 top
R166  10K  [R0603]  103.9,7.9 270 top
R168  10K  [R0603]  113,2 0 top
R185  470R  [R0603]  22.5,58.5 90 top
R186  470R  [R0603]  39.8,58.5 90 top
R187  470R  [R0603]  56.6,58.4 90 top
R188  470R  [R0603]  73.5,58.5 90 top
R189  200R  [R0603]  25,54 270 top
R190  200R  [R0603]  27.5,54 270 top
R191  200R  [R0603]  58.5,54 270 top
R192  200R  [R0603]  61,54 270 top
R193  1K  [R0603]  77,33 90 top
R194  10K  [R0603]  62.1,24.9 180 top
R195  1K  [R0603]  65,33 90 top
R196  1K  [R0603]  59,33 270 top
R205  470R  [R0603]  34.3,58.5 90 top
R206  470R  [R0603]  51.5,58.5 90 top
R207  470R  [R0603]  68.5,58.5 90 top
R208  470R  [R0603]  85.5,58.5 90 top
R_OV_B  10K  [R0603]  23.7,29.6 90 top
R_OV_T  280K  [R0805]  23.7,33.8 90 top
R_UV_B  10K  [R0603]  26.1,29.6 90 top
R_UV_T  100K  [R0805]  26.1,33.8 90 top
S1  ZX-QC36-4.3TPWD  [TACTILE_SWITCH_SMD_6.0X3.5MM]  155.1,93 0 top
S2  ZX-QC36-4.3TPWD  [TACTILE_SWITCH_SMD_6.0X3.5MM]  165,93 0 top
SD3  TF-01A-ZYD9AH1.85  [TF-PULL]  164.95,68 270 top
SJ4  DNI  [SJ]  30.4,24.6 180 top
SW1  KCD11-BL  [KCD11-BL]  172.5,16.75 270 top
U1  SN74LVC2G17DBVR  [SOT95P280X145-6N']  120.5,9.5 90 top
U2  EL357N-G  [OPTO_EL357N-G]  113,32.5 180 top
U2_AL  EL357N-G  [OPTO_EL357N-G]  92,33 270 top
U3  LM5060MMX  [MUB10A]  18.3,36.1 0 top
U4  ADUM1200ARZ-RL7  [SOIC127P600X175-8N]  102.9,33.7 180 top
U6  W25Q128  [SOIC8_208MIL]  128,91 270 top
U8  EL357N-G  [OPTO_EL357N-G]  106,3 0 top
U9  AM26LS31CDRG4  [SOIC127P600X175-16N]  38,46 0 top
U10  SN74LV1T08  [SOT23-5]  92.8,3.3 270 top
U11  EL357N-G  [OPTO_EL357N-G]  39.5,4.5 180 top
U12  CBMUD1201LAS8  [SOIC-8]  107.7,17.5 270 top
U13  SN75176BDR  [SOIC127P599X175-8N]  116.7,17.5 0 top
U14  EL357N-G  [OPTO_EL357N-G]  25.1,18.5 0 top
U15  EL357N-G  [OPTO_EL357N-G]  108,12.5 0 top
U16  EL357N-G  [OPTO_EL357N-G]  99.5,25 180 top
U19  ADUM1200ARZ-RL7  [SOIC127P600X175-8N]  114.5,6.5 0 top
U20_EGATE  74HC08D-T  [SOIC127P600X175-14N]  73.5,8 270 top
U22  EL357N-G  [OPTO_EL357N-G]  113.1,27.3 0 top
U23  EL357N-G  [OPTO_EL357N-G]  39.5,9 180 top
U25  SN74LV1T08  [SOT23-5]  92.8,7.8 270 top
U26  ADUM1200ARZ-RL7  [SOIC127P600X175-8N]  28.6,48 0 top
U27  ADUM1200ARZ-RL7  [SOIC127P600X175-8N]  47,48 0 top
U28  ADUM1200ARZ-RL7  [SOIC127P600X175-8N]  99.4,48 0 top
U30  ADUM1200ARZ-RL7  [SOIC127P600X175-8N]  90,48 0 top
U32  EL357N-G  [OPTO_EL357N-G]  86,33 270 top
U33  AM26LS31CDRG4  [SOIC127P600X175-16N]  108,46.8 0 top
U36  AM26LS31CDRG4  [SOIC127P600X175-16N]  73.5,46 0 top
U37  ADUM1200ARZ-RL7  [SOIC127P600X175-8N]  64.3,48 0 top
U38  ADUM1200ARZ-RL7  [SOIC127P600X175-8N]  82,48 0 top
U45  ADUM1200ARZ-RL7  [SOIC127P600X175-8N]  20.1,48 0 top
U46  ADUM1200ARZ-RL7  [SOIC127P600X175-8N]  56,48 0 top
U47  EL357N-G  [OPTO_EL357N-G]  50,33 270 top
U48  EL357N-G  [OPTO_EL357N-G]  74,33 270 top
U90  EL357N-G  [OPTO_EL357N-G]  44,33 270 top
U91  EL357N-G  [OPTO_EL357N-G]  62,33 270 top
U92  EL357N-G  [OPTO_EL357N-G]  56,33 270 top
U93  EL357N-G  [OPTO_EL357N-G]  39.5,13.5 0 top
U94  EL357N-G  [OPTO_EL357N-G]  39.5,19.5 0 top
U95  EL357N-G  [OPTO_EL357N-G]  38,33 270 top
U96  EL357N-G  [OPTO_EL357N-G]  68,33 270 top
U100  EL357N-G  [OPTO_EL357N-G]  80,33 270 top
U$1  [Z]  74.85,91.05 0 top
U$3  [LIM__VLIM__GND__AL#__AL#__V#__V#]  25,61.5 90 top
U$4  [AUX1]  7.2,29 270 top
U$5  [PUL#_PUL#_DIR#_DIR#_EN#_EN#_H#]  34,61.5 90 top
U$6  [LIM__VLIM__GND__AL#__AL#__V#__V#]  42,61.5 90 top
U$7  [ESTOP]  161.8,43.8 90 top
U$8  [LASER]  7.2,17.4 270 top
U$9  [TOOLSET]  7.2,54.9 270 top
U$10  [PROBE]  7.2,40 270 top
U$11  [SPINDLE]  157.75,23.5 90 top
U$12  [RAIL]  115.65,82.45 0 top
U$13  [ESTOP]  117.9,34.4 315 top
U$14  [RING]  107.65,82.45 0 top
U$16  [SD_CARD]  154.9,60.7 90 top
U$17  [PUL#_PUL#_DIR#_DIR#_EN#_EN#_H#]  51,61.5 90 top
U$18  [LIM__VLIM__GND__AL#__AL#__V#__V#]  59,61.5 90 top
U$19  [USB]  161,79.5 0 top
U$20  [PUL#_PUL#_DIR#_DIR#_EN#_EN#_H#]  68,61.5 90 top
U$21  [LIM__VLIM__GND__AL#__AL#__V#__V#]  76,61.5 90 top
U$22  [PUL#_PUL#_DIR#_DIR#_EN#_EN#_H#]  85,61.5 90 top
U$23  [Y1]  40.85,91.05 0 top
U$24  [Y2]  57.9,91.05 0 top
U$25  [X]  23.85,91.05 0 top
U$26  [LIM__VLIM__GND__AL#__AL#__V#__V#]  93,61.5 90 top
U$27  [PUL#_PUL#_DIR#_DIR#_EN#_EN#_H#]  102,61.5 90 top
U$28  [5V_SIG_GND]  122.4,70.5 90 top
U$30  [EXP]  81,12.5 0 top
U$31  [A]  91.85,91.05 0 top
U$32  [HTTPS###SIENCI#COM#]  82.5,41.5 0 top
U$33  [24#48V]  14.2,78.2 270 top
U$34  [TOOLSET]  7.2,43.6 90 bottom
U$35  [PROBE]  7.2,32 90 bottom
U$36  [AUX1]  7.2,21 90 bottom
U$37  [LASER]  7.2,6.1 90 bottom
U$38  [SPINDLE]  157.25,37 270 bottom
U$39  [ESTOP]  161.8,51.7 270 bottom
VR1  AMS1117-3.3  [AMS1117-3.3]  116.2,90 0 top
WC4  100nF  [C0603]  125.51,51.38 345 top
WC5  100nF  [C0603]  125.51,43.62 15 top
WC6  100nF  [C0603]  129.39,36.89 45 top
WC7  100nF  [C0603]  136.12,33.01 75 top
WC8  100nF  [C0603]  143.88,33.31 105 top
WC9  100nF  [C0603]  150.61,36.89 135 top
WC10  100nF  [C0603]  154.49,43.62 165 top
WC11  100nF  [C0603]  154.49,51.38 195 top
WC12  100nF  [C0603]  150.61,58.11 225 top
WC13  100nF  [C0603]  143.88,61.99 255 top
WC14  100nF  [C0603]  135.92,61.69 285 top
WC15  100nF  [C0603]  129.39,58.11 315 top
WL4  WS2812-2020  [LED_WS2812-2020]  125.5,47.5 270 top
WL5  WS2812-2020  [LED_WS2812-2020]  127.44,40.25 300 top
WL6  WS2812-2020  [LED_WS2812-2020]  132.75,34.94 330 top
WL7  WS2812-2020  [LED_WS2812-2020]  140,33 0 top
WL8  WS2812-2020  [LED_WS2812-2020]  147.25,34.94 30 top
WL9  WS2812-2020  [LED_WS2812-2020]  152.56,40.25 60 top
WL10  WS2812-2020  [LED_WS2812-2020]  154.5,47.5 90 top
WL11  WS2812-2020  [LED_WS2812-2020]  152.56,54.75 120 top
WL12  WS2812-2020  [LED_WS2812-2020]  147.25,60.06 150 top
WL13  WS2812-2020  [LED_WS2812-2020]  140,62 180 top
WL14  WS2812-2020  [LED_WS2812-2020]  132.75,60.06 210 top
WL15  WS2812-2020  [LED_WS2812-2020]  127.44,54.75 240 top
X4  RP2350B  [QFN80]  137,75.5 0 top
Y1  12MHz_10pF_50ohm  [CRYSTAL_3.2X2.5]  135.79,65.81 270 top

## Tracks (layer width: path | path; a pad name or v marks a point on that pad's centre or on a via)
1.2V  (via drill 0.35)
  Top 0.203: C33.2 146.67,76.07 146.09,75.5 v145.9,75.5 144.21,75.5 143.91,75.19 143.26,75.19 142.76,75.7 X4.51 141.6,75.7 141.2,76.1 139.3,76.1 139.1,75.9 139.1,73.6 138.9,73.4 137.9,73.4 137.6,73.1 X4.32 137.6,69.4 139.97,67.03 140.73,67.03 141.6,66.15 C14.2 | X4.65 139.2,79.9 138.8,79.5 v138.6,79.5 | L1.1 140.4,83.85 v140.4,84.9 138.94,86.36 C15.2 | X4.10 131.89,75.68 C8.2 128.65,76.18 C16.1
  Top 0.254: v128.2,78.9 128.65,78.45 C16.1
  Bottom 0.254: v138.6,79.5 137.8,79.5 137.3,80 137.3,82.6 139.6,84.9 v140.4,84.9 | v145.9,75.5 145.1,76.3 145.1,76.6 144.6,77.1 143.95,77.1 141.05,80 139.1,80 v138.6,79.5 | v128.2,78.9 129.5,78.9 130.2,79.6 130.2,79.9 131.9,81.6 136.1,81.6 136.4,81.3 136.4,78.88 137.07,78.21 138.11,78.21 138.6,78.7 v138.6,79.5
!RESET  (via drill 0.35)
  Top 0.203: X4.35 138.8,69.71 140.41,68.1 141.16,68.1 141.61,67.65 143,67.65 143.71,66.94 143.71,65.89 146.01,63.6 148.51,63.6 148.96,64.05 R21.2
  Top 0.254: S1.2 157.05,94.2 v156,94.2 | R21.2 148.96,66.06 149.6,66.7 149.6,72.55 v150.15,73.1
  Bottom 0.254: v156,94.2 156.3,94.5 168.7,94.5 169.6,93.6 169.6,93.1 167.2,90.7 167.2,81.8 169.6,79.4 169.6,58.9 | 169.6,58.9 169.6,56.69 DEBUG.5 | v150.15,73.1 150.78,73.1 151.71,72.17 151.71,70.77 151.95,70.52 158.85,70.52 161.33,68.04 161.33,66.54 162.76,65.11 162.76,61.01 164.28,59.5 169,59.5 169.6,58.9
+24V1
  pour Top (no thermals): 146.9,18.03 146.88,17.98 142,13.1 142,9 145,9 145.2,9.2 145.2,11.67 145.22,11.72 145.58,12.08 145.63,12.1 150,12.1 150,14.5 149.03,14.5 148.98,14.52 148.02,15.48 148,15.53 148,17.97 148.02,18.02 149.18,19.18 149.23,19.2 156,19.2 156,20.7 155.9,20.8 152.23,20.8 152.18,20.82 149.6,23.4 139.3,23.4 139.3,18.3 141,18.3 143.48,20.78 143.53,20.8 146.8,20.8 146.84,20.78 146.88,20.74 146.9,20.7
A  (via drill 0.35, 0.39)
  Top 0.254: R49.2 124.2,22.05 | R19.2 124.15,14.5 124.4,14.75 124.4,16.6 123.45,17.55 D16.2 123.6,18.65 123.6,19.9 124.2,20.5 124.2,22.05 | 124.2,22.05 124.15,22 v123,22 122.65,22.35 R48.1 | v158,30 157.8,29.8 157.8,28.5 158.6,27.7 162.1,27.7 164.2,29.8 J25.4
  Bottom 0.254: v123,22 124.47,23.47 133.4,23.47 135.65,25.72 152.3,25.72 156.57,30 v158,30
A_ALARM_5V_N  (via drill 0.39)
  Top 0.254: U32.2 84.7,36.2 v83.5,36.2
  Bottom 0.254: J13.11 97.7,72.3 97.7,64.5 98.7,63.5 98.7,58.29 101.77,55.22 101.77,49.82 102.67,48.92 102.67,43.17 98.06,38.56 95.84,38.56 92.98,35.7 84,35.7 v83.5,36.2
A_LIM_EXT  (via drill 0.39)
  Top 0.254: v91.8,36.5 91.47,36.17 U2_AL.2
  Bottom 0.254: J13.14 96.59,65 98.27,63.32 98.27,58.11 101.34,55.04 101.34,49.64 102.24,48.74 102.24,43.35 97.89,38.99 95.66,38.99 92.8,36.13 92.17,36.13 v91.8,36.5
ADC_AVDD
  Top 0.203: X4.59 142.94,78.9 143.14,79.1 143.14,79.65 143.55,80.06 144.67,80.06 C1.1
  Top 0.254: C1.1 145.29,80.34 145.9,79.73 147.14,79.73 147.56,79.31 150.44,79.31 151.75,78 R4.1
AUX0_MOSFET
  Top 0.813: Q2_RL1.P3 12.88,5.06 D30_RL1.A 15.07,5.97 15.3,6.2 F1_RL1.2
AUX0_MOSFET_OUT  (via drill 0.35)
  Top 0.813: F1_RL1.1 v15.3,9
  Bottom 0.813: v15.3,9 6.6,17.7 6.6,20.8 4.4,23 J17.2
B  (via drill 0.39)
  Top 0.254: R18.2 123.24,15.95 122.49,16.7 121.6,16.7 121.4,16.9 121.4,18.35 D16.1 121.05,19.45 120.8,19.7 120.8,25.9 121.15,26.25 R46.2 122.75,26.25 123.1,25.9 123.1,24.65 123.8,23.95 | v123,23.1 123,23.3 123.65,23.95 123.8,23.95 | 123.8,23.95 R49.1
  Bottom 0.254: v123,23.1 123.5,23.1 124.3,23.9 133.26,23.9 135.49,26.13 152.13,26.13 157.01,31.01 J25.3
CONN_USB_D_N
  Top 0.254: L13.4 155.3,83.25 D27.3 | D27.4 159.8,83.25 160.05,83.25 162.05,85.25 J14.B7 164.95,85.25 165.2,85.5 165.2,86.1 165.05,86.25 J14.A7
  Top 0.406: D27.3 159.8,83.25
CONN_USB_D_P
  Top 0.254: L13.1 155.3,85.15 D27.1 | J14.A6 161.95,85.75 | D27.6 161.35,85.15 161.95,85.75 | J14.B6 161.95,86.75 161.7,86.5 161.7,86 161.95,85.75
  Top 0.406: D27.1 D27.6
D0_UART0_RX  (via drill 0.35, 0.39)
  Top 0.203: X4.77 134.4,79.5 v135.5,78.4
  Top 0.254: J5.5 58.11,18 58.11,22.31 v58.5,22.7
  Bottom 0.254: v58.5,22.7 59.45,23.64 63.39,23.64 64.86,25.11 65.59,25.11 66.09,25.62 66.62,25.62 67.39,26.39 95.39,26.39 96.53,27.53 97.25,27.53 97.97,28.24 101.28,28.24 101.91,27.61 103.86,27.61 104.99,28.74 108.59,28.74 110.67,30.81 130.4,30.81 132.62,33.04 149.21,33.04 153.7,37.52 153.7,38.32 155.81,40.43 155.81,50.14 153.21,52.74 153.21,60.12 150.28,63.05 146.42,63.05 143.19,66.29 142.16,66.29 140.39,68.06 140.39,71.74 139.59,72.53 139.59,77.13 139.33,77.39 136.31,77.39 135.5,78.2 v135.5,78.4
D1_UART0_TX  (via drill 0.35, 0.39)
  Top 0.203: v134.3,78.6 134.3,79 134,79.3 X4.78
  Top 0.254: J5.7 60.65,18 60.65,22.35 v61,22.7
  Bottom 0.254: v61,22.7 61.54,23.24 63.56,23.24 65.03,24.71 65.76,24.71 66.26,25.21 66.79,25.21 67.56,25.98 95.56,25.98 96.69,27.12 97.42,27.12 98.13,27.83 101.12,27.83 101.75,27.2 104.03,27.2 105.16,28.33 108.76,28.33 110.83,30.41 130.57,30.41 132.79,32.63 149.38,32.63 154.1,37.35 154.1,38.15 156.22,40.26 156.22,50.31 153.62,52.91 153.62,60.29 150.44,63.46 146.59,63.46 143.36,66.69 142.33,66.69 140.79,68.23 140.79,71.91 140,72.7 140,77.3 139.5,77.8 136.9,77.8 135.6,79.1 135.2,79.1 134.7,78.6 v134.3,78.6
D2/M3_LIMIT  (via drill 0.35, 0.39)
  Top 0.203: X4.79 133.6,79.6 v133.3,79.3 | v125.4,72.9 126.12,72.18 126.12,71.58 116.88,62.33 116.88,48.08 114.5,45.7 114.5,44.8 115.1,44.2 115.1,43.7 114.7,43.3 114.5,43.3 114,42.8 v114,42.5
  Top 0.254: C138.1 93.27,27.92 U2_AL.4 92.58,29.82 91.8,30.6 v91.8,31.5 | C138.1 R141.2 | C138.1 93.6,27.6 94.1,28.1 v94.3,28.1 | v104.24,56.96 104.61,56.96 R1.2
  Bottom 0.203: v125.4,72.9 125.47,72.83 129.14,72.83 129.87,73.56 129.87,75.16 132.31,77.6 132.31,78.51 133.1,79.3 v133.3,79.3
  Bottom 0.254: v104.24,56.96 104.24,56.41 104.36,56.29 104.36,51.67 106,50.04 106,45.47 105.63,45.11 105.63,44.52 104.38,43.27 103.95,43.27 98.41,37.73 96.22,37.73 91.8,33.3 v91.8,31.5 | v114,42.5 113.91,42.41 113.19,42.41 112.51,43.09 111.24,43.09 106.52,38.37 106.52,35.09 104.81,33.38 102.53,33.38 97.44,28.29 94.49,28.29 v94.3,28.1
D3/M4_LIMIT  (via drill 0.35, 0.39)
  Top 0.203: X4.80 132.5,80.6 v132.2,80.9 | v126,73.6 126.08,73.6 126.48,73.2 126.48,71.43 117.23,62.19 117.23,47.93 115.3,46 v115.3,44.9
  Top 0.254: v69.81,59.41 69.81,59.04 R15.2 | v68,30.9 68.19,30.9 U96.4 69.27,27.92 C128.1 | C128.1 R128.2 | C128.1 69.05,27.7 v70.1,27.7
  Bottom 0.203: v132.2,80.9 132.2,79.8 131.96,79.56 131.96,77.75 129.51,75.3 129.51,73.7 129,73.19 126.41,73.19 v126,73.6
  Bottom 0.254: v69.81,59.41 70.21,59.01 70.21,57.13 71.09,56.24 71.09,46.27 70.43,45.61 70.43,42.62 69.23,41.42 69.23,37.71 64.81,33.28 64.81,32.5 66.41,30.9 v68,30.9 | v70.1,27.7 70.7,28.3 76,28.3 76.41,28.71 82.06,28.71 82.46,29.11 87.21,29.11 87.62,29.52 93,29.52 93.39,29.92 96.77,29.92 102.02,35.17 102.02,36.56 105.38,39.91 105.77,39.91 110.56,44.71 115.11,44.71 v115.3,44.9
D4_Z_LIMIT  (via drill 0.35, 0.39)
  Top 0.203: X4.1 131.6,79.61 v131.6,80.2 | v126.1,74.6 126.83,73.87 126.83,71.28 117.59,62.04 117.59,47.78 115.9,46.09 115.9,44 v115.8,43.9
  Top 0.254: R16.2 87.35,57.65 v86.7,57 | v78.3,32 79.09,32 U100.4 81.27,27.92 C130.1 | C130.1 R131.2 | C130.1 v82.1,27.6
  Bottom 0.203: v126.1,74.6 126.8,73.9 127,73.9 127.36,73.54 128.85,73.54 129.16,73.85 129.16,75.45 131.6,77.89 v131.6,80.2
  Bottom 0.254: v86.7,57 86.5,57.2 84,57.2 83.63,57.57 81.21,57.57 75.86,52.22 75.86,48.78 77.13,47.52 77.13,39.88 78.33,38.68 78.33,32.03 v78.3,32 | v82.1,27.6 82.8,28.3 87.55,28.3 87.96,28.71 93.33,28.71 93.73,29.11 97.11,29.11 102.2,34.19 104.47,34.19 105.71,35.43 105.71,38.7 110.9,43.9 113.6,43.9 114.2,43.3 115.3,43.3 115.8,43.8 v115.8,43.9
D5_Y_LIMIT  (via drill 0.35, 0.39)
  Top 0.203: X4.2 131.3,78.9 130.9,79.3 v130.9,79.6 | v127.1,74.7 127.19,74.61 127.19,71.14 117.94,61.89 117.94,47.54 116.5,46.1 v116.5,45.8
  Top 0.254: v56,29.9 57.2,29.9 U92.4 57.27,28.77 56.95,28.45 C126.1 | C126.1 R127.2 | C126.1 v58.1,27.6 | R14.2 53.05,57.65 v52.8,57.9
  Bottom 0.203: v130.9,79.6 131.1,79.4 131.1,77.9 128.8,75.6 128.8,74.3 128.4,73.9 127.6,73.9 127.1,74.4 v127.1,74.7
  Bottom 0.254: v52.8,57.9 51.3,57.9 50.5,57.1 49.7,57.1 49.16,57.64 44.89,57.64 40.26,53.01 40.26,39.14 43.03,36.37 53.53,36.37 54.5,35.4 54.5,31.4 v56,29.9 | v58.1,27.6 58.5,27.6 59.2,28.3 70.12,28.3 70.53,28.71 75.83,28.71 76.24,29.11 81.89,29.11 82.3,29.52 87.05,29.52 87.45,29.93 92.83,29.93 93.23,30.33 96.6,30.33 101.61,35.34 101.61,36.73 105.21,40.32 105.6,40.32 110.4,45.12 114.04,45.12 114.52,45.59 116.39,45.59 116.5,45.7 v116.5,45.8
D6_X_LIMIT  (via drill 0.35, 0.39)
  Top 0.203: X4.3 130.7,78.5 v130.5,78.7 | v128.1,74.5 128.1,73.7 127.54,73.15 127.54,70.99 118.3,61.74 118.3,47.1 v117.4,46.2
  Top 0.254: R31.2 36.7,57.65 35.6,58.75 v35.6,58.8 | v44.1,29.8 44.12,29.82 U90.4 45.27,28.77 45.05,28.55 C123.1 | C123.1 45.05,25 R126.2 | C123.1 45.65,27.6 45.85,27.8 v46.3,27.8
  Bottom 0.203: v130.5,78.7 130.5,77.8 128.1,75.4 v128.1,74.5
  Bottom 0.254: v35.6,58.8 36.2,58.2 36.2,56.7 35.16,55.66 35.16,51.07 35.9,50.34 35.9,45.67 35.13,44.91 35.13,37.54 36.58,36.1 41,36.1 41.6,35.5 41.6,30.7 42.5,29.8 v44.1,29.8 | v46.3,27.8 46.4,27.8 46.9,28.3 58.6,28.3 59.01,28.71 69.96,28.71 70.36,29.11 75.66,29.11 76.07,29.52 81.72,29.52 82.13,29.93 86.88,29.93 87.28,30.33 92.66,30.33 93.06,30.73 96.44,30.73 101.21,35.5 101.21,36.89 105.04,40.73 105.43,40.73 110.23,45.53 113.88,45.53 114.35,46 115.6,46 116.1,46.5 117,46.5 117.3,46.2 v117.4,46.2
D7_X_MOTOR_FAULT  (via drill 0.35, 0.39)
  Top 0.203: X4.4 131.95,78.14 132.84,78.14 v132.9,78.2 | v114.7,46.7 114.99,46.7 116.52,48.23 116.52,62.48 125.37,71.33 125.37,71.87 v125.4,71.9
  Top 0.254: R205.1 34.89,57.41 v35.6,57.41 | v38,35.3 38.5,34.8 38.5,34.6 39.27,33.83 U95.4 39.27,28.77 38.95,28.45 C51.1 | C51.1 38.75,27.4 R27.1 | C51.1 v40.1,27.6
  Bottom 0.203: v125.4,71.9 126.11,71.9 126.69,72.48 129.29,72.48 130.22,73.41 130.22,75.01 132.67,77.45 132.67,77.7 132.9,77.93 v132.9,78.2
  Bottom 0.254: v35.6,57.41 34.73,56.54 34.73,50.89 35.46,50.16 35.46,45.85 34.7,45.09 34.7,37.4 36.5,35.6 37.7,35.6 v38,35.3 | v40.1,27.6 41.21,28.71 58.43,28.71 58.84,29.11 69.79,29.11 70.19,29.52 75.5,29.52 75.9,29.93 81.55,29.93 81.96,30.33 86.71,30.33 87.11,30.74 92.49,30.74 92.89,31.14 96.27,31.14 100.8,35.67 100.8,37.06 104.87,41.13 105.26,41.13 110.06,45.93 113.71,45.93 114.48,46.7 v114.7,46.7
D8_Y_MOTOR_FAULT  (via drill 0.35, 0.39)
  Top 0.203: X4.6 133.3,77.3 v133.8,77.8 | v124.5,71.5 124.2,71.5 123.9,71.8 122.6,71.8 121.04,70.25 121.04,69.02 114.5,62.47 114.5,61.7 v115,61.2 | v86.3,33.4 86.3,37 86.7,37.4 100.19,37.4 101.1,36.49 106.41,36.49 107.31,35.59 108.59,35.59 109.14,36.13 115.72,36.13 122.57,42.98 122.57,56.07 v122.9,56.4
  Top 0.254: R206.1 51.4,57.9 v50.1,57.9 | v53.1,29.9 53.02,29.82 U47.4 51.27,28.97 50.9,28.6 50.9,27.65 C72.1 R79.1
  Bottom 0.203: v133.8,77.8 133.3,77.3 133.02,77.3 130.58,74.86 130.58,73.26 129.44,72.12 126.84,72.12 125.72,71 125,71 v124.5,71.5 | v122.9,56.4 122.5,56.4 121.54,57.36 120.59,57.36 116.51,61.44 115.24,61.44 v115,61.2
  Bottom 0.254: v50.1,57.9 49.93,58.07 44.72,58.07 39.83,53.19 39.83,39 42.89,35.94 53.35,35.94 54.07,35.22 54.07,30.87 v53.1,29.9 53.89,29.11 58.26,29.11 58.67,29.52 69.62,29.52 70.03,29.93 75.33,29.93 75.73,30.33 81.38,30.33 81.79,30.74 84.94,30.74 86,31.8 86,33.1 v86.3,33.4
D9_Z_MOTOR_FAULT  (via drill 0.35, 0.39)
  Top 0.203: X4.7 134.3,76.9 v134.7,77.3 | v114.5,44 114.1,44.4 114.1,47.11 116.17,49.18 116.17,62.63 123.6,70.06 v123.6,71.1
  Top 0.254: R208.1 v84.2,58 | v75.2,31.9 75.2,29.89 U48.4 75.27,27.92 C137.1 | C137.1 R81.1 | C137.1 v76.1,27.6
  Bottom 0.203: v134.7,77.3 134.34,76.94 133.16,76.94 130.93,74.71 130.93,73.12 129.58,71.77 126.99,71.77 125.62,70.4 124.3,70.4 v123.6,71.1
  Bottom 0.254: v84.2,58 81.03,58 75.43,52.4 75.43,48.6 76.69,47.34 76.69,39.7 77.9,38.5 77.9,34.6 v75.2,31.9 | v76.1,27.6 76.8,28.3 82.22,28.3 82.63,28.71 87.38,28.71 87.79,29.11 93.16,29.11 93.56,29.51 96.94,29.51 102.03,34.6 104.3,34.6 105.3,35.6 105.3,38.87 110.73,44.31 114.19,44.31 v114.5,44
D10_M3_MOTOR_FAULT  (via drill 0.35, 0.39)
  Top 0.203: X4.8 134.4,76.5 v134.7,76.2 | v122.6,70.8 122.1,70.8 121.4,70.1 121.4,68.87 115.1,62.57 v115.1,62.2 | v85.3,33.4 85.94,34.04 85.94,37.15 86.55,37.76 100.34,37.76 101.25,36.84 106.55,36.84 107.45,35.94 108.45,35.94 108.99,36.49 115.58,36.49 122.21,43.12 122.21,57.11 v122.5,57.4
  Top 0.254: R207.1 69,58 v69.4,58.4 | v64.3,30.2 63.92,29.82 U91.4 63.27,27.92 C127.1 R194.1
  Bottom 0.203: v134.7,76.2 134.6,76.2 134.31,76.49 133.21,76.49 131.29,74.57 131.29,72.97 129.73,71.41 127.13,71.41 125.62,69.89 123.5,69.89 v122.6,70.8 | v122.5,57.4 122.18,57.72 120.74,57.72 116.66,61.8 115.5,61.8 v115.1,62.2
  Bottom 0.254: v69.4,58.4 69.4,57.33 70.66,56.06 70.66,46.45 70,45.79 70,42.8 68.8,41.6 68.8,37.85 64.3,33.35 v64.3,30.2 65.1,30.2 65.37,29.93 69.45,29.93 69.86,30.33 75.16,30.33 75.56,30.74 81.22,30.74 81.62,31.14 84.77,31.14 85.59,31.97 85.59,33.11 v85.3,33.4
D11_M4_MOTOR_FAULT  (via drill 0.35, 0.39)
  Top 0.203: X4.9 133.5,76.1 v133.8,75.8 | v113.4,43.2 113.7,43.5 113.7,47.22 115.81,49.33 115.81,62.78 122.2,69.17 v122.2,69.9
  Top 0.254: R161.2 102.9,57.6 v103.5,57.6 | v86.3,31.1 86.7,31.1 87.27,30.53 U32.4 87.27,27.92 C96.1 | C96.1 R119.2 | C96.1 87.9,27.6 v88.2,27.9
  Bottom 0.203: v133.8,75.8 133.03,75.8 131.65,74.42 131.65,72.82 129.88,71.06 127.28,71.06 125.77,69.54 122.56,69.54 v122.2,69.9
  Bottom 0.254: v103.5,57.6 103.5,56.54 103.93,56.12 103.93,51.49 105.56,49.86 105.56,45.65 105.2,45.29 105.2,44.7 104.2,43.7 103.81,43.7 98.24,38.13 96.02,38.13 91.79,33.9 88.7,33.9 86.3,31.5 v86.3,31.1 | v88.2,27.9 88.6,28.3 93.5,28.3 93.9,28.7 97.28,28.7 102.36,33.79 104.64,33.79 106.11,35.26 106.11,38.54 111.07,43.49 113.11,43.49 v113.4,43.2
D12_X_DIR
  Top 0.203: X4.11 130.2,75.3 127.9,73 127.9,70.84 118.66,61.6 118.66,46.35 116.7,44.4 116.7,42.14 114.25,39.69 102.43,39.69 101.52,40.6 78.5,40.6 77.53,39.64 60.87,39.64 60.15,40.36 59.15,40.36 58.08,39.28 43.58,39.28 42.96,38.66 32.65,38.66 31.4,39.9 31.4,43.4 30.18,44.62 28.57,44.62 27.99,45.2 25.3,45.2 24.7,45.8 24.7,47 25.07,47.37 U26.3
D13_Y_DIR  (via drill 0.35)
  Top 0.203: X4.12 130.3,74.9 128.26,72.85 128.26,70.69 119.01,61.45 119.01,46.21 117.06,44.25 117.06,41.99 114.4,39.33 102.28,39.33 101.37,40.24 78.64,40.24 77.68,39.28 60.72,39.28 60,40 59.3,40 58.23,38.93 44.23,38.93 v43.8,38.5
  Top 0.254: v42.3,47.2 43,47.2 43.2,47.4 44.5,47.4 U27.3
  Bottom 0.254: v42.3,47.2 42.3,47.4 42,47.7 41.5,47.7 41.07,47.27 41.07,39.5 42.17,38.4 43.7,38.4 v43.8,38.5
D14_Z_DIR  (via drill 0.35)
  Top 0.203: X4.13 130.41,74.5 128.61,72.7 128.61,70.55 119.37,61.3 119.37,46.06 117.41,44.1 117.41,41.84 114.55,38.98 102.13,38.98 101.22,39.89 79.22,39.89 v78.9,39.57
  Top 0.254: U38.3 78.55,47.37 78.19,47 78.19,45.2 78.39,45 v78.9,45
  Bottom 0.254: v78.9,39.57 78.59,39.57 77.98,40.18 77.98,42.68 79,43.7 79,44.9 v78.9,45
D15_A_DIR  (via drill 0.35)
  Top 0.203: X4.14 130.51,74.1 128.97,72.56 128.97,70.4 119.72,61.16 119.72,45.91 118,44.19 v118,42.8
  Top 0.254: U28.3 95.77,47.37 95.6,47.2 95.6,45.1 95.8,44.9 99.95,44.9 103.25,41.61 111.41,41.61 v112.2,42.4
  Bottom 0.254: v112.2,42.4 112.53,42.4 113.12,41.8 116.6,41.8 117.6,42.8 v118,42.8
D16_Y2_DIR  (via drill 0.35)
  Top 0.203: X4.16 130.21,73.3 129.32,72.41 129.32,70.25 120.08,61.01 120.08,44.01 114.69,38.62 101.99,38.62 101.08,39.53 79.93,39.53 79.33,38.93 60.47,38.93 60.1,39.3 v59.5,39.3
  Top 0.254: U37.3 60.5,47.37 60.23,47.1 60.23,44.23 v60.1,44.1
  Bottom 0.254: v59.5,39.3 59.5,39.83 59.52,39.85 59.52,43.52 v60.1,44.1
D17_X_STEP
  Top 0.203: X4.17 130.31,72.9 129.68,72.26 129.68,70.11 120.43,60.86 120.43,43.86 114.84,38.27 101.84,38.27 100.93,39.18 80.08,39.18 79.47,38.57 44.87,38.57 44.05,37.76 43.54,37.76 43,38.3 32.5,38.3 31.04,39.76 31.04,43.25 30.03,44.26 28.42,44.26 27.84,44.84 25.16,44.84 24.34,45.66 24.34,47.74 25.23,48.63 U26.2
D18_Y_STEP  (via drill 0.35)
  Top 0.203: X4.18 130.62,72.5 130.03,71.92 130.03,69.96 120.79,60.71 120.79,43.71 114.99,37.91 101.69,37.91 100.78,38.82 80.23,38.82 79.61,38.2 45,38.2 44.2,37.4 43,37.4 v42.7,37.7
  Top 0.254: U27.2 42.84,48.63 v42.5,48.3
  Bottom 0.254: v42.5,48.3 41.37,48.3 40.66,47.6 40.66,39.34 42.3,37.7 v42.7,37.7
D19_Z_STEP  (via drill 0.35)
  Top 0.203: X4.19 130.89,72.1 130.39,71.6 130.39,69.81 121.14,60.57 121.14,43.57 115.13,37.56 101.54,37.56 100.63,38.47 80.57,38.47 80,37.9 v80,37.6
  Top 0.254: U38.2 78.59,48.63 77.76,47.8 77.76,44.9 78,44.66 v78,44.3
  Bottom 0.254: v78,44.3 77.57,43.87 77.57,40.02 78.69,38.9 78.7,38.9 v80,37.6
D20_A_STEP  (via drill 0.35)
  Top 0.203: X4.20 131.2,71.7 130.75,71.24 130.75,69.66 121.5,60.42 121.5,43.42 115.28,37.2 108.3,37.2 v108,36.9
  Top 0.254: U28.2 96.23,48.63 95.1,47.5 95.1,44.99 95.62,44.47 99.78,44.47 103.04,41.2 112.4,41.2 v112.6,41.4
  Bottom 0.254: v108,36.9 108,39.27 110.13,41.4 v112.6,41.4
D21_Y2_STEP  (via drill 0.35)
  Top 0.203: X4.21 133.2,70.8 132.9,71.1 131.4,71.1 131.1,70.8 131.1,69.52 121.86,60.27 121.86,43.27 115.43,36.84 108.84,36.84 108.3,36.3 107.6,36.3 106.7,37.2 101.4,37.2 100.49,38.11 81.5,38.11 80.34,36.94 79.76,36.94 78.86,37.84 59.24,37.84 v58.8,37.4
  Top 0.254: U37.2 60.53,48.63 60.2,48.3 60.2,47.99 59.8,47.59 59.8,44.9 v59,44.1
  Bottom 0.254: v58.8,37.4 58.8,39.7 59.12,40.02 59.12,43.98 v59,44.1
D22_PROBE  (via drill 0.35)
  Top 0.203: v115,42.5 115.2,42.3 115.2,41.65 113.96,40.4 102.72,40.4 101.81,41.31 78.2,41.31 77.24,40.35 61.16,40.35 60.44,41.07 58.86,41.07 57.78,39.99 43.29,39.99 42.66,39.37 33.83,39.37 v32.3,40.9 | X4.22 133.6,69.81 132.94,69.16 131.82,69.16 122.62,59.96 122.62,58.82 124.08,57.36 124.08,55.94 123.33,55.19 123.33,42.66 122.88,42.22 v122.88,41.82 v122.89,41.81
  Top 0.254: C125.1 44.15,14.35 43.73,14.77 U93.4 41.13,14.77 40.75,15.15 | R12.2 8.39,29.11 8.39,15.53 12.13,11.79 31.94,11.79 32.59,11.14 37.61,11.14 38.51,12.04 38.51,14.41 v38.95,14.85 40.45,14.85 40.75,15.15 | 40.75,15.15 R125.2
  Bottom 0.203: 115.1,42.5 115.2,42.5 115.8,43.1 116.86,43.1 117.51,43.76 118.45,43.76 120.67,41.53 122.61,41.53 v122.89,41.81 | v32.3,40.9 32.74,40.46 32.74,35.34 34.64,33.44 34.64,26.87 36.9,24.61 36.9,22.9 38.95,20.85 v38.95,14.85
  Bottom 0.254: v115,42.5 115.1,42.5
D23_TLS_PROBE  (via drill 0.35)
  Top 0.203: v116,42.4 115.6,42 115.6,41.54 114.1,40.05 102.58,40.05 101.66,40.96 78.35,40.96 77.39,39.99 61.01,39.99 60.3,40.71 59.01,40.71 57.93,39.64 43.44,39.64 42.81,39.01 33.09,39.01 v32.1,40 | X4.23 134,69.64 133.16,68.8 131.96,68.8 122.97,59.81 122.97,58.97 124.44,57.51 124.44,55.8 123.68,55.04 123.68,41.92 v123.8,41.8
  Top 0.254: 40,21.4 40.63,20.77 U94.4 43.83,20.77 44.3,20.3 44.95,20.3 C124.1 | 40,21.4 40,19.8 38.11,17.91 | R11.2 7.5,40.95 6.95,40.4 4.25,40.4 3.02,39.17 2.67,39.17 2.1,38.6 2.1,33 2.7,32.4 7.5,32.4 8.8,31.1 8.8,15.8 12.4,12.2 32.1,12.2 32.76,11.54 37.44,11.54 38.11,12.21 38.11,17.91 | v36.7,21.9 37.2,21.9 38.11,20.99 38.11,17.91 | 40,21.4 40,22.15 R124.2
  Bottom 0.203: v116,42.4 116.66,42.4 117.66,43.4 118.3,43.4 120.53,41.17 123.38,41.17 123.8,41.6 v123.8,41.8 | v32.1,40 32.39,39.71 32.39,35.19 34.29,33.3 34.29,26.72 36.54,24.46 36.54,22.75 36.7,22.6 v36.7,21.9
D24_XYA_HOME_EN  (via drill 0.35, 0.39)
  Top 0.203: X4.25 134.8,71.2 134.26,71.75 134.26,73.56 v134.4,73.7
  Top 0.254: v98.4,34.2 98.9,33.7 101.8,33.7 102.44,33.06 U4.2 | v113.79,70.91 v113.79,70.89 113.1,70.2 113.1,69.05 R75.1 | D19.C 106.95,70.85 v106.9,70.9
  Bottom 0.203: v134.4,73.7 133.03,73.7 130.03,70.7 127.43,70.7 125.91,69.18 115.61,69.18 115.3,69.5 115.3,70.9 115,71.2 114.09,71.2 v113.79,70.91
  Bottom 0.254: v113.79,70.91 111.59,70.91 111.29,70.6 107.2,70.6 v106.9,70.9 106.6,70.6 104.5,70.6 103.06,69.16 103.06,60.66 105.81,57.91 105.81,56.31 105.65,56.15 105.65,52.21 107.29,50.57 107.29,44.94 106.96,44.61 106.96,44.02 104.92,41.97 104.53,41.97 99.21,36.65 99.21,35.01 v98.4,34.2
D25_Z_HOME_EN  (via drill 0.35, 0.39)
  Top 0.203: X4.26 135.2,71.31 134.8,71.7 134.8,72.7 v134.9,72.8
  Top 0.254: v100,36.5 99.4,36.5 99,36.1 99,35.3 99.3,35 101.8,35 102.47,34.34 U4.3 | v114.6,70.4 114,69.8 114,66.1 113.9,66 R62.1 111.83,66 109.83,68 107.95,68 D29.C
  Bottom 0.203: v134.9,72.8 134.3,72.8 133.76,73.34 133.17,73.34 130.17,70.34 127.58,70.34 126.06,68.83 115.27,68.83 114.49,69.6 114.49,70.29 | 114.4,70.2 v114.6,70.4
  Bottom 0.254: v100,36.5 100.09,36.59 100.09,36.93 104.7,41.54 105.09,41.54 107.39,43.84 107.39,44.43 107.72,44.76 107.72,50.75 106.09,52.39 106.09,55.97 106.24,56.13 106.24,58.09 103.49,60.84 103.49,68.98 104.68,70.17 111.47,70.17 111.8,70.5 113.1,70.5 113.4,70.2 114.4,70.2 | 114.49,70.29 v114.6,70.4
D26_SR0_OE  (via drill 0.35)
  Top 0.203: X4.27 135.6,71.61 v135.84,71.86
  Top 0.254: v154.6,41.3 155.43,41.3 159.8,36.92 v159.8,36.3 | v72.9,22.11 73.35,21.66 73.35,18.74 74.09,18 75.89,18 J5.21 | IC1_SREXP.13 93.86,18.36 v93.9,18.4 | R65.1 v83.2,10.6
  Route2 0.254: v93.9,18.4 92.7,18.4 91.8,17.5 89.77,17.5 89.19,16.92 89.19,13.82 86.48,11.11 83.71,11.11 v83.2,10.6
  Route2 0.305: v93.9,18.4 95.19,18.4 95.7,17.89 100.3,17.89 100.71,18.3 100.71,21.98 v100.69,22
  Bottom 0.254: v154.6,41.3 154.6,41.4 154.9,41.7 154.9,49.9 152.4,52.41 152.4,59.78 149.94,62.24 146.09,62.24 142.85,65.47 141.83,65.47 138.5,68.8 137.1,68.8 136.34,69.56 136.34,71.06 135.84,71.56 v135.84,71.86 | v159.8,36.3 159.8,36.15 151.4,27.75 134.81,27.75 132.59,25.53 112.85,25.53 109.62,22.3 100.99,22.3 v100.69,22 100.2,22 99.87,22.33 73.12,22.33 v72.9,22.11
D27_PWM_SPINDLE_DETECT  (via drill 0.35)
  Top 0.203: X4.28 136,71.1 v136.8,71.9
  Top 0.254: R33.2 113.45,34.36 110.32,31.23 U2.4 108.83,31.23 108.39,30.8 108.2,30.8 | C200.1 107.7,31.3 108.2,30.8 | 108.2,30.8 v108.2,30.1 | v131.6,33.4 131.6,33 133.6,31 147.8,31 154.55,37.75 R13.2
  Bottom 0.254: v108.2,30.1 109.3,30.1 110.42,31.22 130.23,31.22 131.6,32.59 v131.6,33.4 131.64,33.44 149.04,33.44 153.29,37.69 153.29,38.49 155.4,40.6 155.4,49.98 152.8,52.58 152.8,59.95 150.11,62.65 146.25,62.65 143.02,65.88 142,65.88 138.67,69.21 137.3,69.21 136.8,69.71 v136.8,71.9
D28_LASER_ENABLE  (via drill 0.35)
  Top 0.203: X4.36 139.2,71 138.6,71.6 v138.6,71.7
  Top 0.254: v76.2,8.6 76.04,8.76 U20_EGATE.2
  Route2 0.254: v138.6,71.7 138.6,71.8 139.16,72.36 140.07,72.36 140.42,72.01 143.77,72.01 144.67,71.11 145.89,71.11 v146.6,70.4